# Altium project Main_Board.PrjPCB
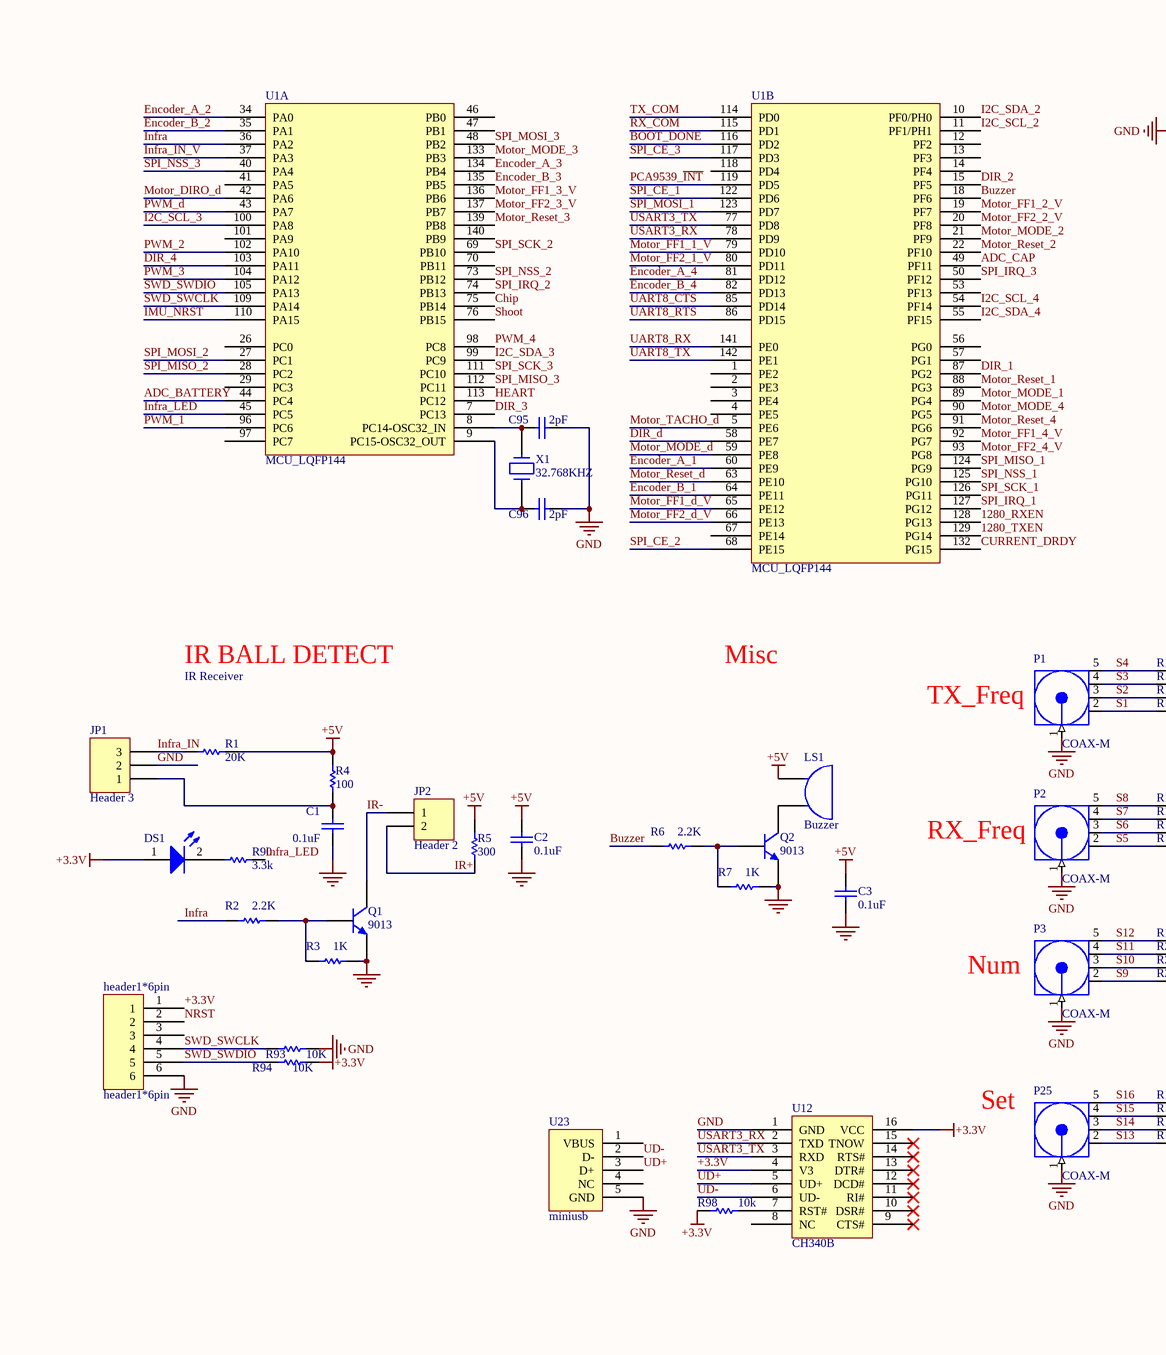
[diagram p0: Main_Board.SchDoc, left]
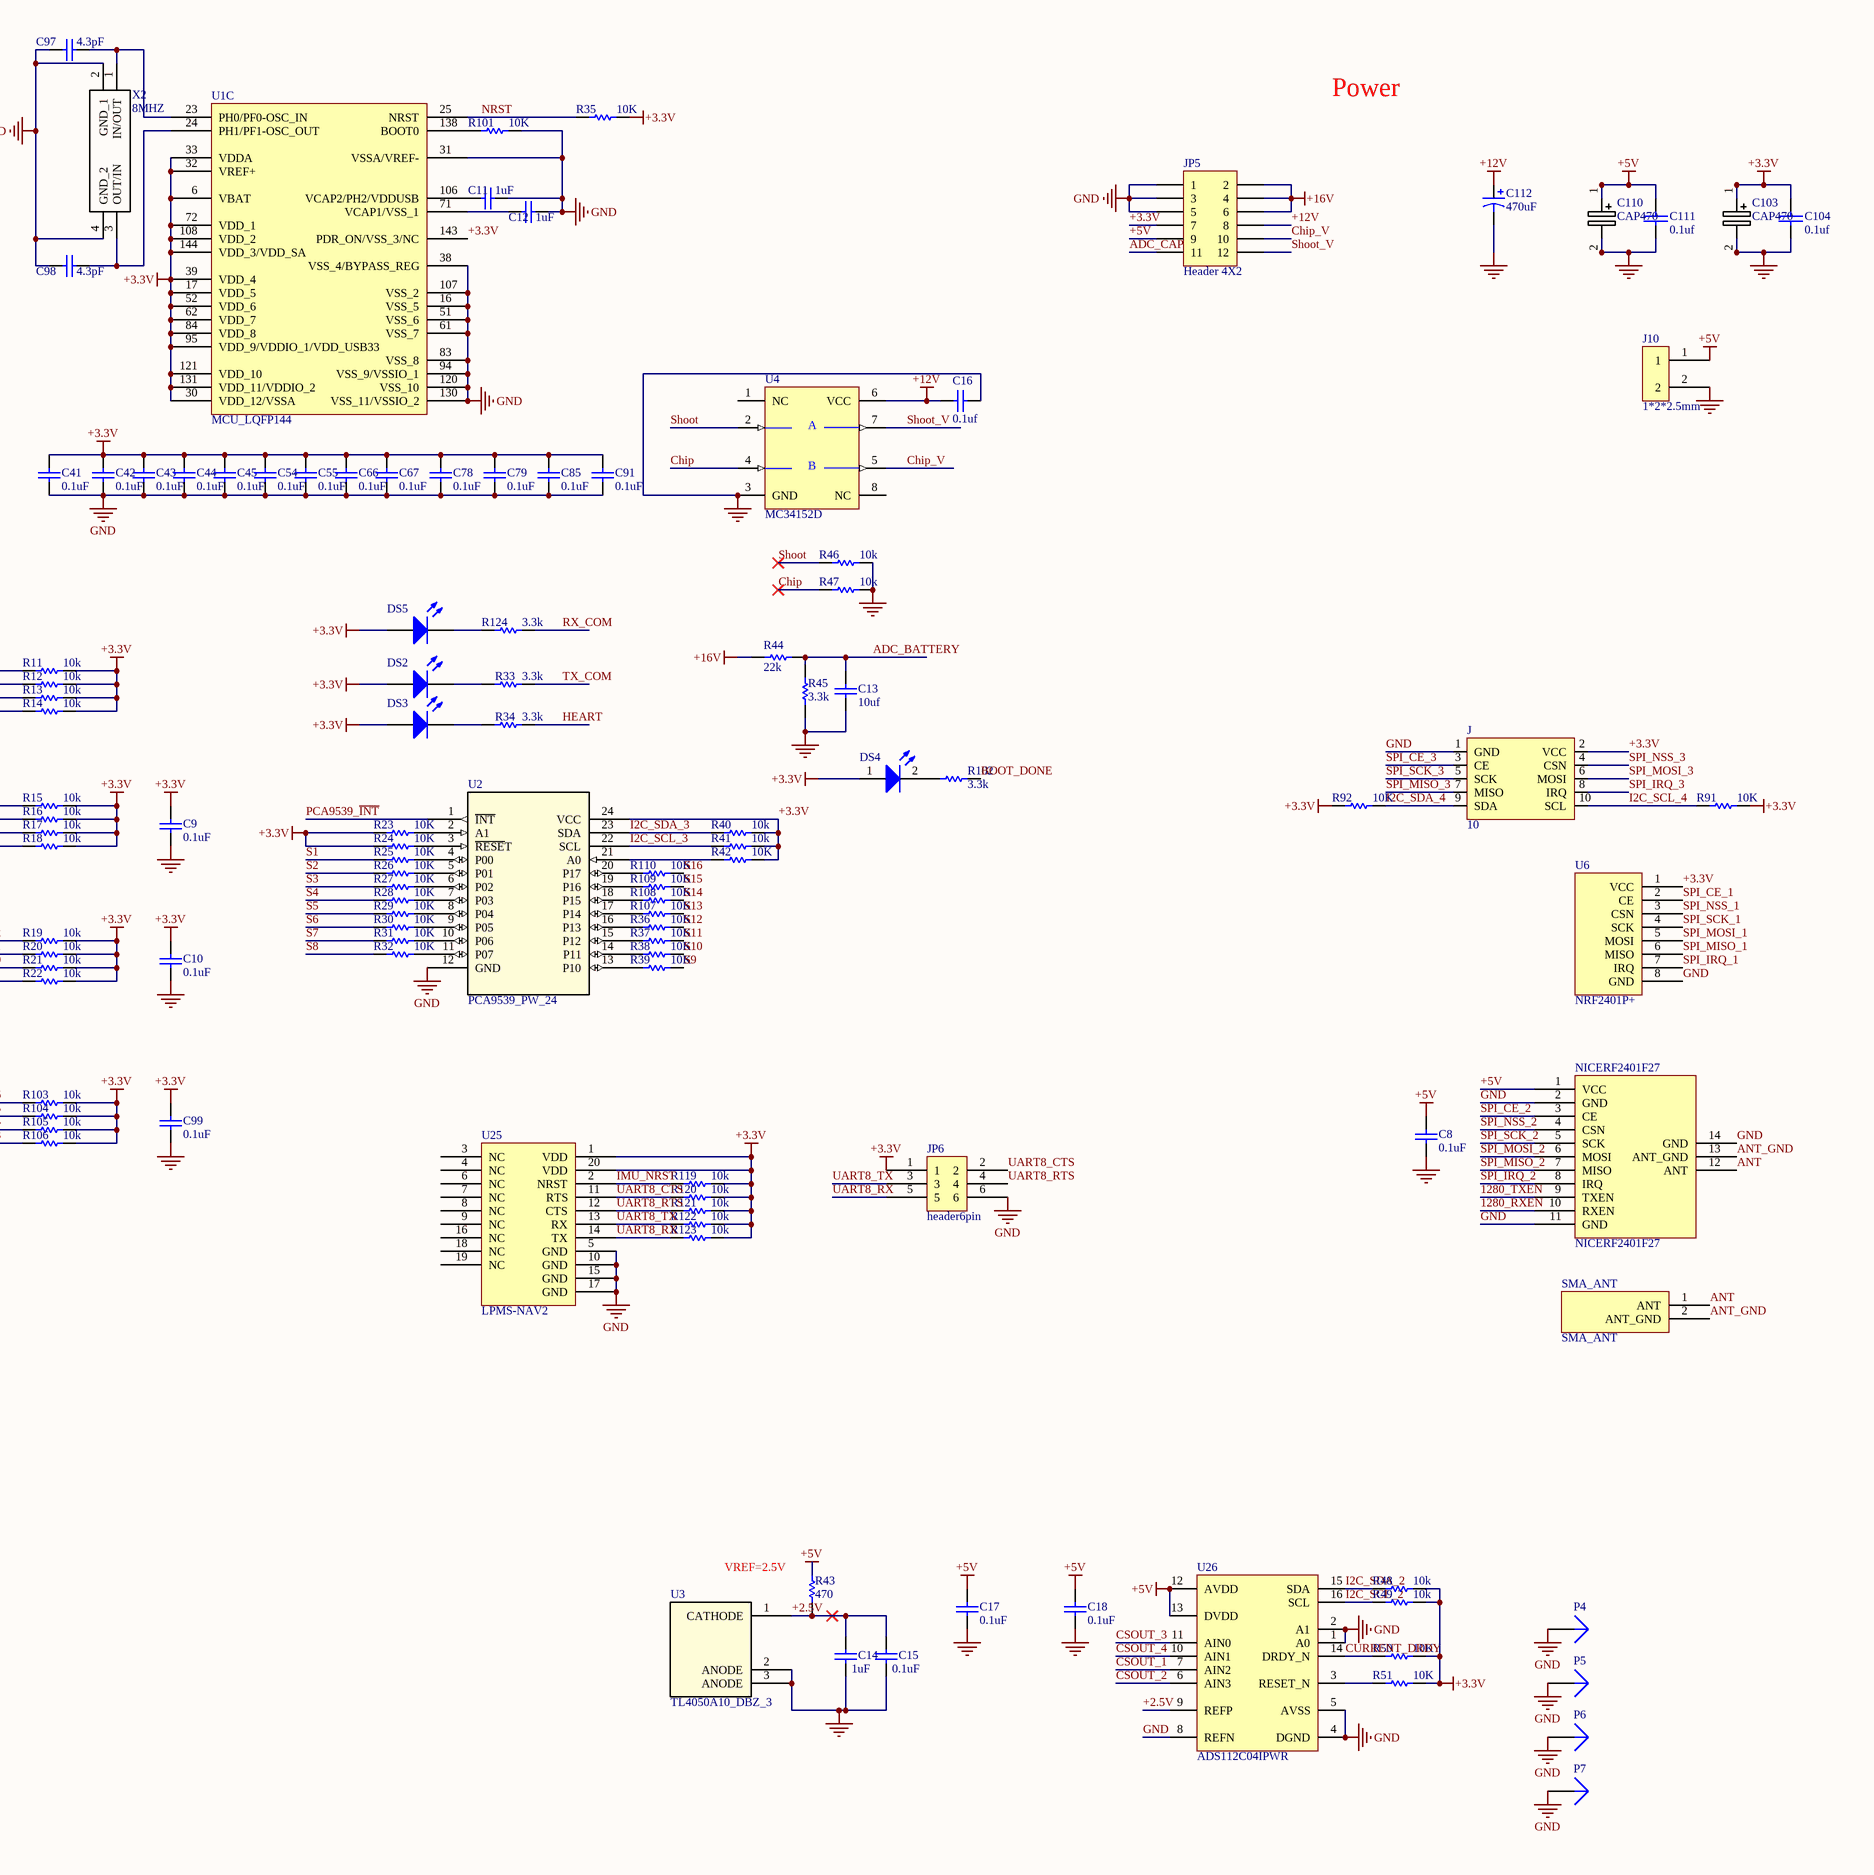
[diagram p1: Main_Board.SchDoc, right]
6 sheets, 298 parts. Net scope: global (net labels, ports and power ports of the same name join across sheets).
Board file: Copy of Main_Board.PcbDoc
Sheets:
  Main_Board.SchDoc
  Motor_1.SchDoc
  Motor_2.SchDoc
  Motor_3.SchDoc
  Motor_4.SchDoc
  Motor_d.SchDoc

## Sheet Main_Board.SchDoc
size A2

### Parts
C1  0.1uf  [0805C]
C2  0.1uf  [0805C]
C3  0.1uf  [0805C]
C8  0.1uF  [0805C]
C9  0.1uf  [0805C]
C10  0.1uf  [0805C]
C11  1uf  [0805C]
C12  1uf  [0805C]
C13  10uf  [0805C]
C14  1uf  [0805C]
C15  0.1uf  [0805C]
C16  0.1uf  [0805C]
C17  0.1uf  [0805C]
C18  0.1uf  [0805C]
C41  0.1uF  [0805C]
C42  0.1uf  [0805C]
C43  0.1uf  [0805C]
C44  0.1uf  [0805C]
C45  0.1uf  [0805C]
C54  0.1uf  [0805C]
C55  0.1uf  [0805C]
C66  0.1uf  [0805C]
C67  0.1uf  [0805C]
C78  0.1uf  [0805C]
C79  0.1uf  [0805C]
C85  0.1uf  [0805C]
C91  0.1uf  [0805C]
C95  2pf  [0805C]
C96  2pf  [0805C]
C97  4.3pf  [0805C]
C98  4.3pf  [0805C]
C99  0.1uF  [0805C]
C103  CAP470  [CAPPM7360X200N]
C104  0.1uf  [0805C]
C110  CAP470  [CAPPM7360X200N]
C111  0.1uf  [0805C]
C112  470uF  [470uF]
DS1  LED2  [0805D]  (value not drawn)
DS2  LED1  [0805D]  (value not drawn)
DS3  LED2  [0805D]  (value not drawn)
DS4  LED2  [0805D]  (value not drawn)
DS5  LED1  [0805D]  (value not drawn)
header1*6pin  header1*6pin  [1*6_2.5mm]
J  10  [10]
J10  1*2*2.5mm  [1*2_2.5mm]
JP1  Header 3  [SHDR3]
JP2  Header 2  [SHDR2]
JP5  Header 4X2  [2*6_2.5mm]
JP6  header6pin  [2*3_2.5mm]
LS1  Buzzer  [Buzzer]
NICERF2401F27  NICERF2401F27  [NICERF2401F27]
P1  COAX-M  [A6RV-161RS]
P2  COAX-M  [A6RV-161RS]
P3  COAX-M  [A6RV-161RS]
P4  安装孔  [安装孔-3.5-5]  (value not drawn)
P5  安装孔  [安装孔-3.5-5]  (value not drawn)
P6  安装孔  [安装孔-3.5-5]  (value not drawn)
P7  安装孔  [安装孔-3.5-5]  (value not drawn)
P25  COAX-M  [A6RV-161RS]
Q1  9013  [SO-G3/Y1]
Q2  9013  [SO-G3/Y1]
R1  20k  [0805R]
R2  2.2k  [0805R]
R3  1k  [0805R]
R4  100  [0805R]
R5  300  [0805R]
R6  2.2k  [0805R]
R7  1k  [0805R]
R11  10k  [0805R]
R12  10k  [0805R]
R13  10k  [0805R]
R14  10k  [0805R]
R15  10k  [0805R]
R16  10k  [0805R]
R17  10k  [0805R]
R18  10k  [0805R]
R19  10k  [0805R]
R20  10k  [0805R]
R21  10k  [0805R]
R22  10k  [0805R]
R23  10k  [0805R]
R24  10k  [0805R]
R25  10k  [0805R]
R26  10k  [0805R]
R27  10k  [0805R]
R28  10k  [0805R]
R29  10k  [0805R]
R30  10k  [0805R]
R31  10k  [0805R]
R32  10k  [0805R]
R33  3.3k  [0805R]
R34  3.3k  [0805R]
R35  10k  [0805R]
R36  10k  [0805R]
R37  10k  [0805R]
R38  10k  [0805R]
R39  10k  [0805R]
R40  10k  [0805R]
R41  10k  [0805R]
R42  10k  [0805R]
R43  470  [0805R]
R44  22k  [0805R]
R45  3.3k  [0805R]
R46  10k  [0805R]
R47  10k  [0805R]
R48  10k  [0805R]
R49  10k  [0805R]
R50  10k  [0805R]
R51  10k  [0805R]
R90  3.3k  [0805R]
R91  10k  [0805R]
R92  10k  [0805R]
R93  10k  [0805R]
R94  10k  [0805R]
R98  10k  [0805R]
R101  10k  [0805R]
R102  3.3k  [0805R]
R103  10k  [0805R]
R104  10k  [0805R]
R105  10k  [0805R]
R106  10k  [0805R]
R107  10k  [0805R]
R108  10k  [0805R]
R109  10k  [0805R]
R110  10k  [0805R]
R119  10k  [0805R]
R120  10k  [0805R]
R121  10k  [0805R]
R122  10k  [0805R]
R123  10k  [0805R]
R124  3.3k  [0805R]
SMA_ANT  SMA_ANT  [SMA_ANT]
U1  MCU_LQFP144  [LQFP144_0R5_SKT]  (parts A,B,C of 3)
U2  PCA9539_PW_24  [PW24-L_pca9539]
U3  TL4050A10_DBZ_3  [DBZ3-L]
U4  MC34152D  [SO-G8]
U6  NRF2401P+  [NRF2401P+_zeyao]
U12  CH340B  [SOP16]
U23  miniusb  [miniusb 180]
U25  LPMS-NAV2  [LPMS-NAV2]
U26  ADS112C04IPWR  [TSSOP_PW0016A_ADS112C04]
X1  32.768KHZ  [FC-255]
X2  8MHZ  [5032]

### Nets
+3.3V: C9.2 C10.2 C41.1 C42.1 C43.1 C44.1 C45.1 C54.1 C55.1 C66.1 C67.1 C78.1 C79.1 C85.1 C91.1 C99.2 C103.1(+) C104.1 DS1.1(A) DS2.1(A) DS3.1(A) DS4.1(A) DS5.1(A) header1*6pin.1 J.2(VCC) JP5.7 JP6.1 R11.2 R12.2 R13.2 R14.2 R15.2 R16.2 R17.2 R18.2 R19.2 R20.2 R21.2 R22.2 R23.1 R24.1 R35.2 R40.2 R41.2 R42.2 R48.2 R49.2 R50.2 R51.2 R91.2 R92.1 R93.1 R98.1 R103.2 R104.2 R105.2 R106.2 R119.2 R120.2 R121.2 R122.2 R123.2 U1.6(VBAT) U1.17(VDD_5) U1.30(VDD_12/VSSA) U1.32(VREF+) U1.33(VDDA) U1.39(VDD_4) U1.52(VDD_6) U1.62(VDD_7) U1.72(VDD_1) U1.84(VDD_8) U1.95(VDD_9/VDDIO_1/VDD_USB33) U1.108(VDD_2) U1.121(VDD_10) U1.131(VDD_11/VDDIO_2) U1.143(PDR_ON/VSS_3/NC) U1.144(VDD_3/VDD_SA) U2.24(VCC) U6.1(VCC) U12.4(V3) U12.16(VCC) U25.1(VDD) U25.20(VDD)
+5V: C2.2 C3.2 C8.1 C17.2 C18.2 C110.1(+) C111.1 J10.1 JP5.9 LS1.1(A) NICERF2401F27.1(VCC) R1.1 R4.2 R5.2 R43.2 U26.12(AVDD) U26.13(DVDD)
+12V: C16.1 C112.1 JP5.8 U4.6(VCC)
+16V: JP5.2 JP5.4 JP5.6 R44.2
GND: C1.2 C2.1 C3.1 C8.2 C9.1 C10.1 C11.1 C12.1 C13.1 C14.1 C15.1 C16.2 C17.1 C18.1 C41.2 C42.2 C43.2 C44.2 C45.2 C54.2 C55.2 C66.2 C67.2 C78.2 C79.2 C85.2 C91.2 C95.2 C96.2 C97.2 C98.2 C99.1 C103.2(-) C104.2 C110.2(-) C111.2 C112.2 header1*6pin.6 J.1(GND) J10.2 JP1.2 JP5.1 JP5.3 JP5.5 JP6.6 NICERF2401F27.2(GND) NICERF2401F27.11(GND) NICERF2401F27.14(GND) P1.1(Signal) P2.1(Signal) P3.1(Signal) P4.1 P5.1 P6.1 P7.1 P25.1(Signal) Q1.2(E) Q2.2(E) R3.2 R7.2 R45.1 R46.1 R47.1 R94.1 R101.2 U1.16(VSS_5) U1.31(VSSA/VREF-) U1.38(VSS_4/BYPASS_REG) U1.51(VSS_6) U1.61(VSS_7) U1.83(VSS_8) U1.94(VSS_9/VSSIO_1) U1.107(VSS_2) U1.120(VSS_10) U1.130(VSS_11/VSSIO_2) U2.12(GND) U3.2(ANODE) U3.3(ANODE) U4.3(GND) U6.8(GND) U12.1(GND) U23.5(GND) U25.5(GND) U25.10(GND) U25.15(GND) U25.17(GND) U26.1(A0) U26.2(A1) U26.4(DGND) U26.5(AVSS) U26.8(REFN) X2.2(GND_1) X2.4(GND_2)
1280_RXEN: NICERF2401F27.10(RXEN) U1.128(PG13)
1280_TXEN: NICERF2401F27.9(TXEN) U1.129(PG14)
+2.5V: C14.2 C15.2 R43.1 U3.1(CATHODE) U26.9(REFP)
ADC_BATTERY: C13.2 R44.1 R45.2 U1.44(PC4)
ADC_CAP: JP5.11 U1.49(PF11)
ANT: NICERF2401F27.12(ANT) SMA_ANT.1(ANT)
ANT_GND: NICERF2401F27.13(ANT_GND) SMA_ANT.2(ANT_GND)
BOOT_DONE: R102.1 U1.116(PD2)
Buzzer: R6.1 U1.18(PF6)
Chip: R47.2 U1.75(PB14) U4.4(INB)
Chip_V: JP5.10 U4.5(~{OUTB})
CSOUT_1: U26.7(AIN2)
CSOUT_2: U26.6(AIN3)
CSOUT_3: U26.11(AIN0)
CSOUT_4: U26.10(AIN1)
CURRENT_DRDY: R50.1 U1.132(PG15) U26.14(DRDY_N)
DIR_1: U1.87(PG2)
DIR_2: U1.15(PF5)
DIR_3: U1.7(PC13)
DIR_4: U1.103(PA11)
DIR_d: U1.58(PE7)
Encoder_A_1: U1.60(PE9)
Encoder_A_2: U1.34(PA0)
Encoder_A_3: U1.134(PB4)
Encoder_A_4: U1.81(PD12)
Encoder_B_1: U1.64(PE11)
Encoder_B_2: U1.35(PA1)
Encoder_B_3: U1.135(PB5)
Encoder_B_4: U1.82(PD13)
HEART: R34.1 U1.113(PC12)
I2C_SCL_2: R49.1 U1.11(PF1/PH1) U26.16(SCL)
I2C_SCL_3: R41.1 U1.100(PA8) U2.22(SCL)
I2C_SCL_4: J.10(SCL) R91.1 U1.54(PF14)
I2C_SDA_2: R48.1 U1.10(PF0/PH0) U26.15(SDA)
I2C_SDA_3: R40.1 U1.99(PC9) U2.23(SDA)
I2C_SDA_4: J.9(SDA) R92.2 U1.55(PF15)
IMU_NRST: R119.1 U1.110(PA15) U25.2(NRST)
Infra: R2.1 U1.36(PA2)
Infra_IN: JP1.3 R1.2
Infra_IN_V: U1.37(PA3)
Infra_LED: R90.1 U1.45(PC5)
IR+: JP2.1(2) R5.1
IR-: JP2.2(1) Q1.3(C)
Motor_DIRO_d: U1.42(PA6)
Motor_FF1_1_V: U1.79(PD10)
Motor_FF1_2_V: U1.19(PF7)
Motor_FF1_3_V: U1.136(PB6)
Motor_FF1_4_V: U1.92(PG7)
Motor_FF1_d_V: U1.65(PE12)
Motor_FF2_1_V: U1.80(PD11)
Motor_FF2_2_V: U1.20(PF8)
Motor_FF2_3_V: U1.137(PB7)
Motor_FF2_4_V: U1.93(PG8)
Motor_FF2_d_V: U1.66(PE13)
Motor_MODE_1: U1.89(PG4)
Motor_MODE_2: U1.21(PF9)
Motor_MODE_3: U1.133(PB3)
Motor_MODE_4: U1.90(PG5)
Motor_MODE_d: U1.59(PE8)
Motor_Reset_1: U1.88(PG3)
Motor_Reset_2: U1.22(PF10)
Motor_Reset_3: U1.139(PB8)
Motor_Reset_4: U1.91(PG6)
Motor_Reset_d: U1.63(PE10)
Motor_TACHO_d: U1.5(PE6)
NRST: header1*6pin.2 R35.1 U1.25(NRST)
PCA9539_~{INT}: U1.119(PD5) U2.1(~{INT})
PWM_1: U1.96(PC6)
PWM_2: U1.102(PA10)
PWM_3: U1.104(PA12)
PWM_4: U1.98(PC8)
PWM_d: U1.43(PA7)
RX_COM: R124.1 U1.115(PD1)
S1: P1.2(GND) R14.1 R25.1
S2: P1.3(GND) R13.1 R26.1
S3: P1.4(GND) R12.1 R27.1
S4: P1.5(GND) R11.1 R28.1
S5: P2.2(GND) R18.1 R29.1
S6: P2.3(GND) R17.1 R30.1
S7: P2.4(GND) R16.1 R31.1
S8: P2.5(GND) R15.1 R32.1
S9: P3.2(GND) R22.1 R39.2
S10: P3.3(GND) R21.1 R38.2
S11: P3.4(GND) R20.1 R37.2
S12: P3.5(GND) R19.1 R36.2
S13: P25.2(GND) R106.1 R107.2
S14: P25.3(GND) R105.1 R108.2
S15: P25.4(GND) R104.1 R109.2
S16: P25.5(GND) R103.1 R110.2
Shoot: R46.2 U1.76(PB15) U4.2(INA)
Shoot_V: JP5.12 U4.7(~{OUTA})
SPI_CE_1: U1.122(PD6) U6.2(CE)
SPI_CE_2: NICERF2401F27.3(CE) U1.68(PE15)
SPI_CE_3: J.3(CE) U1.117(PD3)
SPI_IRQ_1: U1.127(PG12) U6.7(IRQ)
SPI_IRQ_2: NICERF2401F27.8(IRQ) U1.74(PB13)
SPI_IRQ_3: J.8(IRQ) U1.50(PF12)
SPI_MISO_1: U1.124(PG9) U6.6(MISO)
SPI_MISO_2: NICERF2401F27.7(MISO) U1.28(PC2)
SPI_MISO_3: J.7(MISO) U1.112(PC11)
SPI_MOSI_1: U1.123(PD7) U6.5(MOSI)
SPI_MOSI_2: NICERF2401F27.6(MOSI) U1.27(PC1)
SPI_MOSI_3: J.6(MOSI) U1.48(PB2)
SPI_NSS_1: U1.125(PG10) U6.3(CSN)
SPI_NSS_2: NICERF2401F27.4(CSN) U1.73(PB12)
SPI_NSS_3: J.4(CSN) U1.40(PA4)
SPI_SCK_1: U1.126(PG11) U6.4(SCK)
SPI_SCK_2: NICERF2401F27.5(SCK) U1.69(PB10)
SPI_SCK_3: J.5(SCK) U1.111(PC10)
SWD_SWCLK: header1*6pin.4 R94.2 U1.109(PA14)
SWD_SWDIO: header1*6pin.5 R93.2 U1.105(PA13)
TX_COM: R33.1 U1.114(PD0)
UART8_CTS: JP6.2 R120.1 U1.85(PD14) U25.11(RTS)
UART8_RTS: JP6.4 R121.1 U1.86(PD15) U25.12(CTS)
UART8_RX: JP6.5 R123.1 U1.141(PE0) U25.14(TX)
UART8_TX: JP6.3 R122.1 U1.142(PE1) U25.13(RX)
UD+: U12.5(UD+) U23.3(D+)
UD-: U12.6(UD-) U23.2(D-)
USART3_RX: U1.78(PD9) U12.2(TXD)
USART3_TX: U1.77(PD8) U12.3(RXD)
NetC1_1: C1.1 JP1.1 R4.1
NetC11_2: C11.2 U1.106(VCAP2/PH2/VDDUSB)
NetC12_2: C12.2 U1.71(VCAP1/VSS_1)
NetC95_1: C95.1 U1.8(PC14-OSC32_IN) X1.2
NetC96_1: C96.1 U1.9(PC15-OSC32_OUT) X1.1
NetC97_1: C97.1 U1.23(PH0/PF0-OSC_IN) X2.1(IN/OUT)
NetC98_1: C98.1 U1.24(PH1/PF1-OSC_OUT) X2.3(OUT/IN)
NetDS1_2: DS1.2(K) R90.2
NetDS2_2: DS2.2(K) R33.2
NetDS3_2: DS3.2(K) R34.2
NetDS4_2: DS4.2(K) R102.2
NetDS5_2: DS5.2(K) R124.2
NetLS1_2: LS1.2(B) Q2.3(C)
NetQ1_1: Q1.1(B) R2.2 R3.1
NetQ2_1: Q2.1(B) R6.2 R7.1
NetR23_2: R23.2 U2.2(A1)
NetR24_2: R24.2 U2.3(~{RESE}T)
NetR25_2: R25.2 U2.4(P00)
NetR26_2: R26.2 U2.5(P01)
NetR27_2: R27.2 U2.6(P02)
NetR28_2: R28.2 U2.7(P03)
NetR29_2: R29.2 U2.8(P04)
NetR30_2: R30.2 U2.9(P05)
NetR31_2: R31.2 U2.10(P06)
NetR32_2: R32.2 U2.11(P07)
NetR36_1: R36.1 U2.16(P13)
NetR37_1: R37.1 U2.15(P12)
NetR38_1: R38.1 U2.14(P11)
NetR39_1: R39.1 U2.13(P10)
NetR42_1: R42.1 U2.21(A0)
NetR51_1: R51.1 U26.3(RESET_N)
NetR98_2: R98.2 U12.7(RST#)
NetR101_1: R101.1 U1.138(BOOT0)
NetR107_1: R107.1 U2.17(P14)
NetR108_1: R108.1 U2.18(P15)
NetR109_1: R109.1 U2.19(P16)
NetR110_1: R110.1 U2.20(P17)

Not connected (* = marked no-connect by the designer): header1*6pin 3; U1 1(PE2) 2(PE3) 3(PE4) 4(PE5) 12(PF2) 13(PF3) 14(PF4) 26(PC0) 29(PC3) 41(PA5) 46(PB0) 47(PB1) 53(PF13) 56(PG0) 57(PG1) 67(PE14) 70(PB11) 97(PC7) 101(PA9) 118(PD4) 140(PB9); U4 1(NC) 8(NC); U12 8(NC) 9(CTS#)* 10(DSR#)* 11(RI#)* 12(DCD#)* 13(DTR#)* 14(RTS#)* 15(TNOW)*; U23 1(VBUS) 4(NC); U25 3(NC) 4(NC) 6(NC) 7(NC) 8(NC) 9(NC) 16(NC) 18(NC) 19(NC)

### Notes on the sheet
- Power
- IR Receiver
- IR BALL DETECT
- Misc
- (near P1) TX_Freq
- (near P2) RX_Freq
- Num
- (near P25) Set
- VREF=2.5V
- (in symbol MC34152D) A; B

### Library data of the parts
C1-C3 C8-C13 C16 C41-C45 C54 C55 C66 C67 C78 C79 C85 C91 C95-C99 = Cap: Capacitor; Published: 8-Jun-2000; LatestRevisionDate: 17-Jul-2002; LatestRevisionNote: Re-released for DXP Platform.; Publisher: Altium Limited
  C1-C3 C8-C10 C41-C45 C54 C55 C66 C67 C78 C79 C85 C91 C99: Value: 0.1uF
  C11 C12: Value: 1uF
  C95 C96: Value: 2pF
  C97 C98: Value: 4.3pF
C14 C15 C17 C18 = Cap: Capacitor; Manufacturer: Generic Components; Class: Passive; Published: 08/06/2000; Publisher: Altium Hobart Technology Centre; SubClass: Capacitor
  C14: Value: 1uF
  C15 C17 C18: Value: 0.1uF
C103 C110 = T523H477M016APE0707280: 470uF电容贴片; Manufacturer_Name: Kemet; Datasheet Link: https://api.kemet.com/component-edge/download/datasheet/T523H477M016APE0707280.pdf; Height: 2mm; Manufacturer_Part_Number: T523H477M016APE0707280; Mouser Part Number: 80-T523H477M16P070LR; Mouser Price/Stock: https://www.mouser.com/Search/Refine.aspx?Keyword=80-T523H477M16P070LR
C104 C111 = CAP: Capacitor
C112 = Cap Pol1: Polarized Capacitor (Radial); Published: 8-Jun-2000; LatestRevisionDate: 17-Jul-2002; LatestRevisionNote: Re-released for DXP Platform.; PackageReference: RB7.6-15; Publisher: Altium Limited; PackageDescription: Polarized Capacitor (Radial); 2 Leads
DS1 DS4 = LED2: Typical RED, GREEN, YELLOW, AMBER GaAs LED; Manufacturer: Generic Components; Class: Optoelectronic; Published: 08/06/2000; Publisher: Altium Hobart Technology Centre; SubClass: LED
DS2 DS5 = LED1: Typical RED, GREEN, YELLOW, AMBER GaAs LED; Published: 8-Jun-2000; LatestRevisionDate: 17-Jul-2002; LatestRevisionNote: Re-released for DXP Platform.; Publisher: Altium Limited
DS3 = LED2: Typical RED, GREEN, YELLOW, AMBER GaAs LED; Published: 8-Jun-2000; LatestRevisionDate: 17-Jul-2002; LatestRevisionNote: Re-released for DXP Platform.; Publisher: Altium Limited
JP1 = Header 3: Header, 3-Pin; LatestRevisionDate: 17-Jul-2002; LatestRevisionNote: Re-released for DXP Platform.; Publisher: Altium Limited
JP2 = Header 2: Header, 2-Pin; LatestRevisionDate: 17-Jul-2002; LatestRevisionNote: Re-released for DXP Platform.; Publisher: Altium Limited
JP5 = Header 6X2: Header, 4-Pin, Dual row; LatestRevisionDate: 17-Jul-2002; LatestRevisionNote: Re-released for DXP Platform.; Publisher: Altium Limited
LS1 = Buzzer: Manufacturer: Generic Components; Published: 1999
P1-P3 P25 = COAX-M: RF Coaxial PCB Connector, MMCX; Thru-Hole, Vertical Mount Plug,  50 Ohm Impedance; PackageDocument: Rev. A, 16-Jun-1997; PCB_Layout: Complies with manufacturer's recommendation.; DrillSize: Corresponds to nominal value.; Published: 15-Jul-2004; LatestRevisionDate: 15-Jul-2004; LatestRevisionNote: Component Replaced.; DatasheetDocument: 30-May-2003; PackageReference: 908-21103; Publisher: Altium Limited; ComponentLink1Description: Manufacturer Link; ComponentLink1URL: http://www.amphenolrf.com/
P4-P7 = Plug: LatestRevisionDate: 17-Jul-2002; LatestRevisionNote: Re-released for DXP Platform.; Publisher: Altium Limited
Q1 Q2 = BC817-40: NPN General Purpose Amplifier; Manufacturer: Fairchild Semiconductor; Revised: 11-July-2000: SIM Model Added.; Class: Discrete; SubClass: BJT - Low Power; Published: 8/06/2000; Publisher: Altium Hobart Technology Centre
R1-R7 R11-R45 R48-R51 R90-R94 R98 R101-R110 R119-R124 = Res1: Resistor; Manufacturer: Generic Components; Class: Passive; Published: 08/06/2000; Publisher: Altium Hobart Technology Centre; SubClass: Resistor
  R1: Value: 20K
  R2 R6: Value: 2.2K
  R3 R7: Value: 1K
  R4: Value: 100
  R5: Value: 300
  R11-R22 R40 R41 R48 R49 R98 R103-R106 R119-R123: Value: 10k
  R23-R32 R35-R39 R42 R50 R51 R91-R94 R101 R107-R110: Value: 10K
  R33 R34 R45 R90 R102 R124: Value: 3.3k
  R43: Value: 470
  R44: Value: 22k
R46 R47 = SR0805: Resistance; VALUE: 10k
U2 = PCA9539_PW_24: Remote 16-Bit I2C And SMBus, Low-Power I/O Expander With Interrupt Output, Reset & Config. Registers; Vendor: Texas Instruments; PACKAGE_DESIGNATOR: PW; PIN_COUNT: 24; FAMILY_NAME: I2C IO EXPANDER; INDUSTRY_STD_PKG_TYPE: TSSOP; Manufacturer_Part_Number: pca9539_pw_24; GENERIC_PART_NUMBER: PCA9539; Datasheet_URL: http://www.ti.com/lit/gpn/PCA9539; Manufacturer: Texas Instruments; RefDes: RefDes; Type: DEV; Value: Value
U3 = TL4050A10_DBZ_3: Precision Micropower Shunt Voltage Reference; Vendor: Texas Instruments; PACKAGE_DESIGNATOR: DBZ; PIN_COUNT: 3; INDUSTRY_STD_PKG_TYPE: SOT-23; Manufacturer_Part_Number: tl4050a10_dbz_3; GENERIC_PART_NUMBER: TL4050A10; FAMILY_NAME: SHUNT VOLTAGE REFERENCE; Datasheet_URL: http://www.ti.com/lit/gpn/TL4050A10; Manufacturer: Texas Instruments; RefDes: RefDes; Type: DEV; Value: Value
U4 = MC34152D: High Speed Dual MOSFET Driver; Manufacturer: Motorola; Class: Interface; Published: 15/04/2002; Publisher: Altium Hobart Technology Centre; SubClass: MOSFET Driver
U26 = ADS112C04IPWR: Imported; Manufacturer: Texas Instruments; PartNumber: ADS112C04IPWR; RefDes: RefDes; Type: DEV; Value: Value
X1 = CRYSTAL
X2 = ECS-80-18-30B-AGN-TR: Crystal or Oscillator; Manufacturer_Name: ECS; Datasheet Link: http://www.ecsxtal.com/store/pdf/ecx_53b.pdf; Height: 0.85mm; Manufacturer_Part_Number: ECS-80-18-30B-AGN-TR; Mouser Part Number: 520-80-18-30B-AGNT; Mouser Price/Stock: https://www.mouser.com/Search/Refine.aspx?Keyword=520-80-18-30B-AGNT

## Sheet Motor_1.SchDoc
size A4
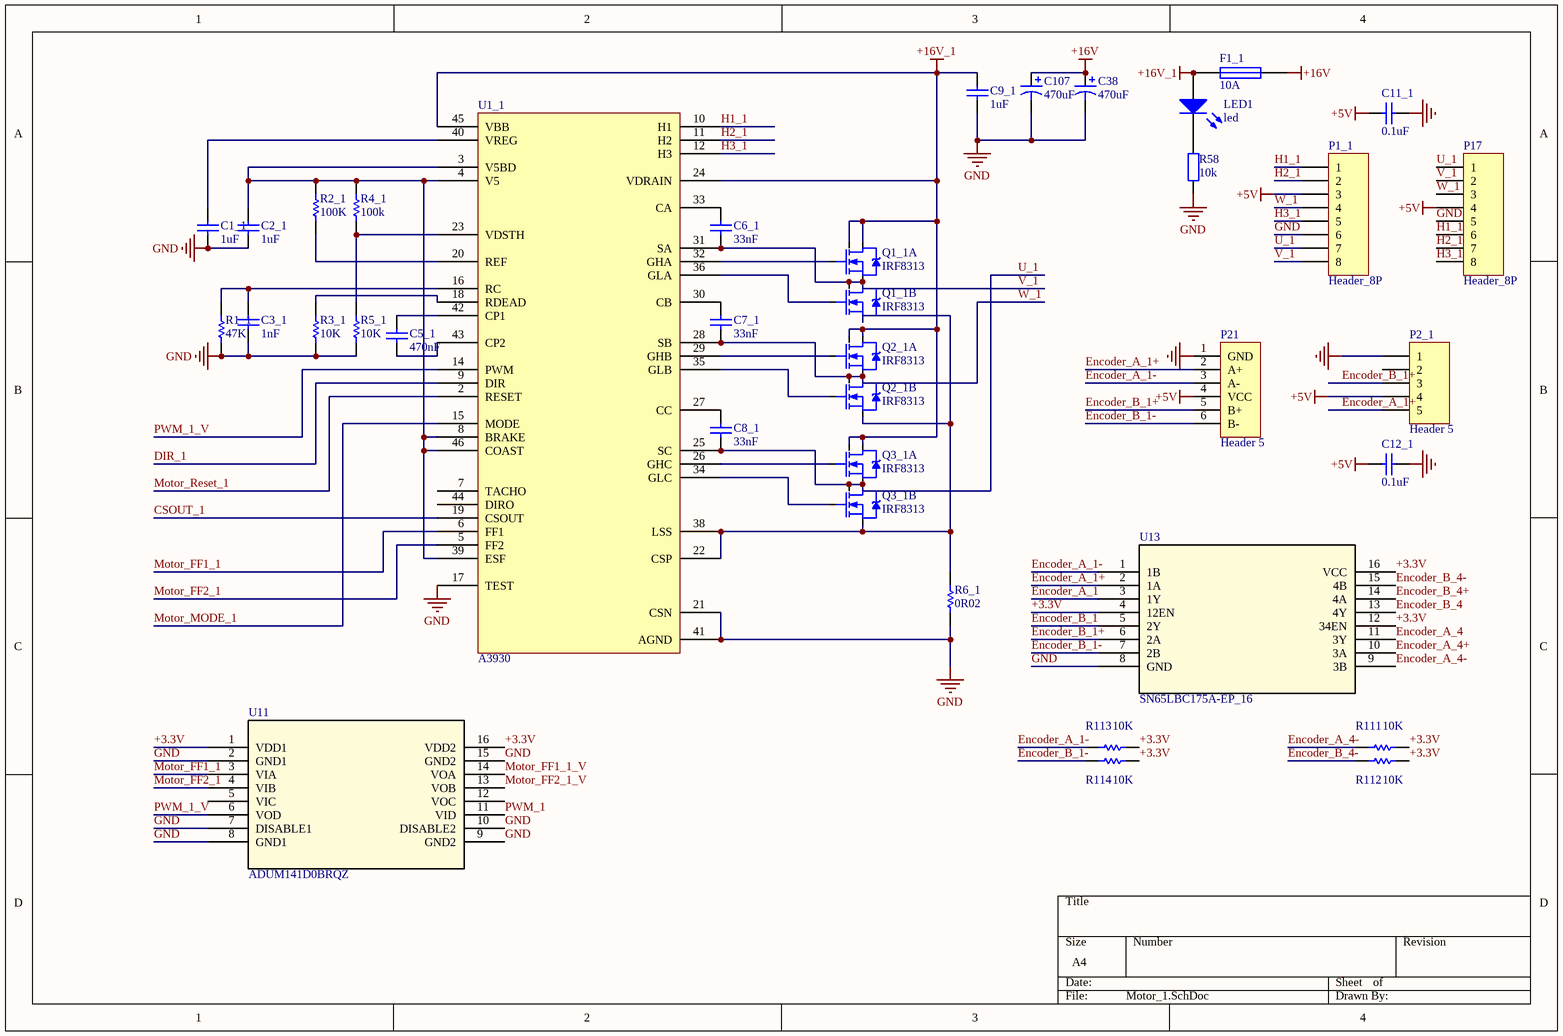
[diagram p2: Motor_1.SchDoc]

### Parts
C1_1  1uf  [0603C]
C2_1  1uf  [0603C]
C3_1  1nf  [0603C]
C5_1  470nf  [0603C]
C6_1  33nf  [0603C]
C7_1  33nf  [0603C]
C8_1  33nf  [0603C]
C9_1  1uf  [0603C]
C11_1  0.1uf  [0603C]
C12_1  0.1uf  [0603C]
C38  470uF  [470uF]
C107  470uF  [470uF]
F1_1  10A  [FUSE_HEADER]
LED1  led  [0603_diode]
P1_1  Header_8P  [8P - WF25122]
P2_1  Header 5  [SHDR5]
P17  Header_8P  [SHDR8]
P21  Header 5  [SHDR6]
Q1_1  IRF8313  [so-8 bg]  (parts A,B of 2)
Q2_1  IRF8313  [so-8 bg]  (parts A,B of 2)
Q3_1  IRF8313  [so-8 bg]  (parts A,B of 2)
R1_1  47k  [0603R]
R2_1  100k  [0603R]
R3_1  10k  [0603R]
R4_1  100k  [0603R]
R5_1  10k  [0603R]
R6_1  value 0R02  [1206 10A]  (hidden comment: 0.02)
R58  10k  [0603]
R111  10k  [0603R]
R112  10k  [0603R]
R113  10k  [0603R]
R114  10k  [0603R]
U1_1  A3930  [LQFP-48]
U11  ADUM141D0BRQZ  [RQ_16]
U13  SN65LBC175A-EP_16  [SOP16]

### Nets
+3.3V: R111.1 R112.1 R113.1 R114.1 U11.1(VDD1) U11.16(VDD2) U13.4(12EN) U13.12(34EN) U13.16(VCC)
+5V: C11_1.2 C12_1.2 P1_1.3 P2_1.4 P17.4 P21.4(VCC)
+16V: C38.1 C107.1 F1_1.1
+16V_1: C9_1.2 F1_1.2 LED1.1(A) Q1_1.7(D2) Q1_1.8(D2) Q2_1.7(D2) Q2_1.8(D2) Q3_1.7(D2) Q3_1.8(D2) U1_1.24(VDRAIN) U1_1.45(VBB)
GND: C1_1.1 C2_1.1 C3_1.1 C9_1.1 C11_1.1 C12_1.1 C38.2 C107.2 P1_1.6 P2_1.1 P17.5 P21.1(GND) R1_1.1 R3_1.1 R5_1.1 R6_1.1 R58.1 U1_1.17(TEST) U1_1.21(CSN) U1_1.41(AGND) U11.2(GND1) U11.7(DISABLE1) U11.8(GND1) U11.9(GND2) U11.10(DISABLE2) U11.15(GND2) U13.8(GND)
CSOUT_1: U1_1.19(CSOUT)
DIR_1: U1_1.9(DIR)
Encoder_A_1: U13.3(1Y)
Encoder_A_1+: P2_1.5 P21.2(A+) U13.2(1A)
Encoder_A_1-: P21.3(A-) R113.2 U13.1(1B)
Encoder_A_4: U13.11(3Y)
Encoder_A_4+: U13.10(3A)
Encoder_A_4-: R111.2 U13.9(3B)
Encoder_B_1: U13.5(2Y)
Encoder_B_1+: P2_1.3 P21.5(B+) U13.6(2A)
Encoder_B_1-: P21.6(B-) R114.2 U13.7(2B)
Encoder_B_4: U13.13(4Y)
Encoder_B_4+: U13.14(4A)
Encoder_B_4-: R112.2 U13.15(4B)
H1_1: P1_1.1 P17.6 U1_1.10(H1)
H2_1: P1_1.2 P17.7 U1_1.11(H2)
H3_1: P1_1.5 P17.8 U1_1.12(H3)
Motor_FF1_1: U1_1.6(FF1) U11.3(VIA)
Motor_FF1_1_V: U11.14(VOA)
Motor_FF2_1: U1_1.5(FF2) U11.4(VIB)
Motor_FF2_1_V: U11.13(VOB)
Motor_MODE_1: U1_1.15(MODE)
Motor_Reset_1: U1_1.2(RESET)
PWM_1: U11.11(VID)
PWM_1_V: U1_1.14(PWM) U11.6(VOD)
U_1: C8_1.1 P1_1.7 P17.1 Q3_1.1(S2) Q3_1.5(D1) Q3_1.6(D1) U1_1.25(SC)
V_1: C6_1.1 P1_1.8 P17.2 Q1_1.1(S2) Q1_1.5(D1) Q1_1.6(D1) U1_1.31(SA)
W_1: C7_1.1 P1_1.4 P17.3 Q2_1.1(S2) Q2_1.5(D1) Q2_1.6(D1) U1_1.28(SB)
NetC1_1_2: C1_1.2 U1_1.40(VREG)
NetC2_1_2: C2_1.2 R2_1.2 R4_1.2 U1_1.3(V5BD) U1_1.4(V5) U1_1.8(BRAKE) U1_1.39(ESF) U1_1.46(COAST)
NetC3_1_2: C3_1.2 R1_1.2 U1_1.16(RC)
NetC5_1_1: C5_1.1 U1_1.43(CP2)
NetC5_1_2: C5_1.2 U1_1.42(CP1)
NetC6_1_2: C6_1.2 U1_1.33(CA)
NetC7_1_2: C7_1.2 U1_1.30(CB)
NetC8_1_2: C8_1.2 U1_1.27(CC)
NetLED1_2: LED1.2(K) R58.2
NetQ1_1_2: Q1_1.2(G2) U1_1.32(GHA)
NetQ1_1_3: Q1_1.3(S1) Q2_1.3(S1) Q3_1.3(S1) R6_1.2 U1_1.22(CSP) U1_1.38(LSS)
NetQ1_1_4: Q1_1.4(G1) U1_1.36(GLA)
NetQ2_1_2: Q2_1.2(G2) U1_1.29(GHB)
NetQ2_1_4: Q2_1.4(G1) U1_1.35(GLB)
NetQ3_1_2: Q3_1.2(G2) U1_1.26(GHC)
NetQ3_1_4: Q3_1.4(G1) U1_1.34(GLC)
NetR2_1_1: R2_1.1 U1_1.20(REF)
NetR3_1_2: R3_1.2 U1_1.18(RDEAD)
NetR4_1_1: R4_1.1 R5_1.2 U1_1.23(VDSTH)

Not connected (* = marked no-connect by the designer): P2_1 2; U1_1 7(TACHO) 44(DIRO); U11 5(VIC) 12(VOC)

### Library data of the parts
C1_1 C2_1 C3_1 C5_1 C6_1 C7_1 C8_1 C9_1 C11_1 C12_1 = Cap: as C14 on sheet Main_Board; Published: 08/06/2000; Publisher: Altium Hobart Technology Centre; SubClass: Capacitor
  C1_1 C2_1 C9_1: Value: 1uF
  C3_1: Value: 1nF
  C5_1: Value: 470nF
  C6_1 C7_1 C8_1: Value: 33nF
  C11_1 C12_1: Value: 0.1uF
C38 C107 = Cap Pol1: Polarized Capacitor (Radial); Published: 8-Jun-2000; LatestRevisionDate: 17-Jul-2002; LatestRevisionNote: Re-released for DXP Platform.; PackageReference: RB7.6-15; Publisher: Altium Limited; PackageDescription: Polarized Capacitor (Radial); 2 Leads
F1_1 = FUSE
P1_1 P17 = Header_8P: Used for Motor connection in ZJUNlict
P2_1 = Header 5: Header, 5-Pin; LatestRevisionDate: 17-Jul-2002; LatestRevisionNote: Re-released for DXP Platform.; Publisher: Altium Limited
P21 = Header 6: Header, 5-Pin; LatestRevisionDate: 17-Jul-2002; LatestRevisionNote: Re-released for DXP Platform.; Publisher: Altium Limited
Q1_1 Q2_1 Q3_1 = SO-8 IRF8313
R1_1 R2_1 R3_1 R4_1 R5_1 R6_1 R111-R114 = Res1: as R1 on sheet Main_Board; Published: 08/06/2000; Publisher: Altium Hobart Technology Centre; SubClass: Resistor
  R1_1: Value: 47K
  R2_1: Value: 100K
  R3_1 R5_1 R111-R114: Value: 10K
  R4_1: Value: 100k
R58 = res
U1_1 = LQFP 48
U11 = ADUM141D0BRQZ: Imported; RefDes: RefDes; Type: DEV; Value: Value
U13 = SN65LBC175A-EP_16: Quadruple 2-Input Positive-NAND Gates; Manufacturer: Texas Instruments; GENERIC_PART_NUMBER: 74AC11000; INDUSTRY_STD_PKG_TYPE: SOIC; PIN_COUNT: 16; PACKAGE_DESIGNATOR: D; Datasheet_URL: http://www.ti.com/lit/gpn/74AC11000; FAMILY_NAME: NAND GATE; RefDes: RefDes; Type: DEV; Value: Value

## Sheet Motor_2.SchDoc
size A4
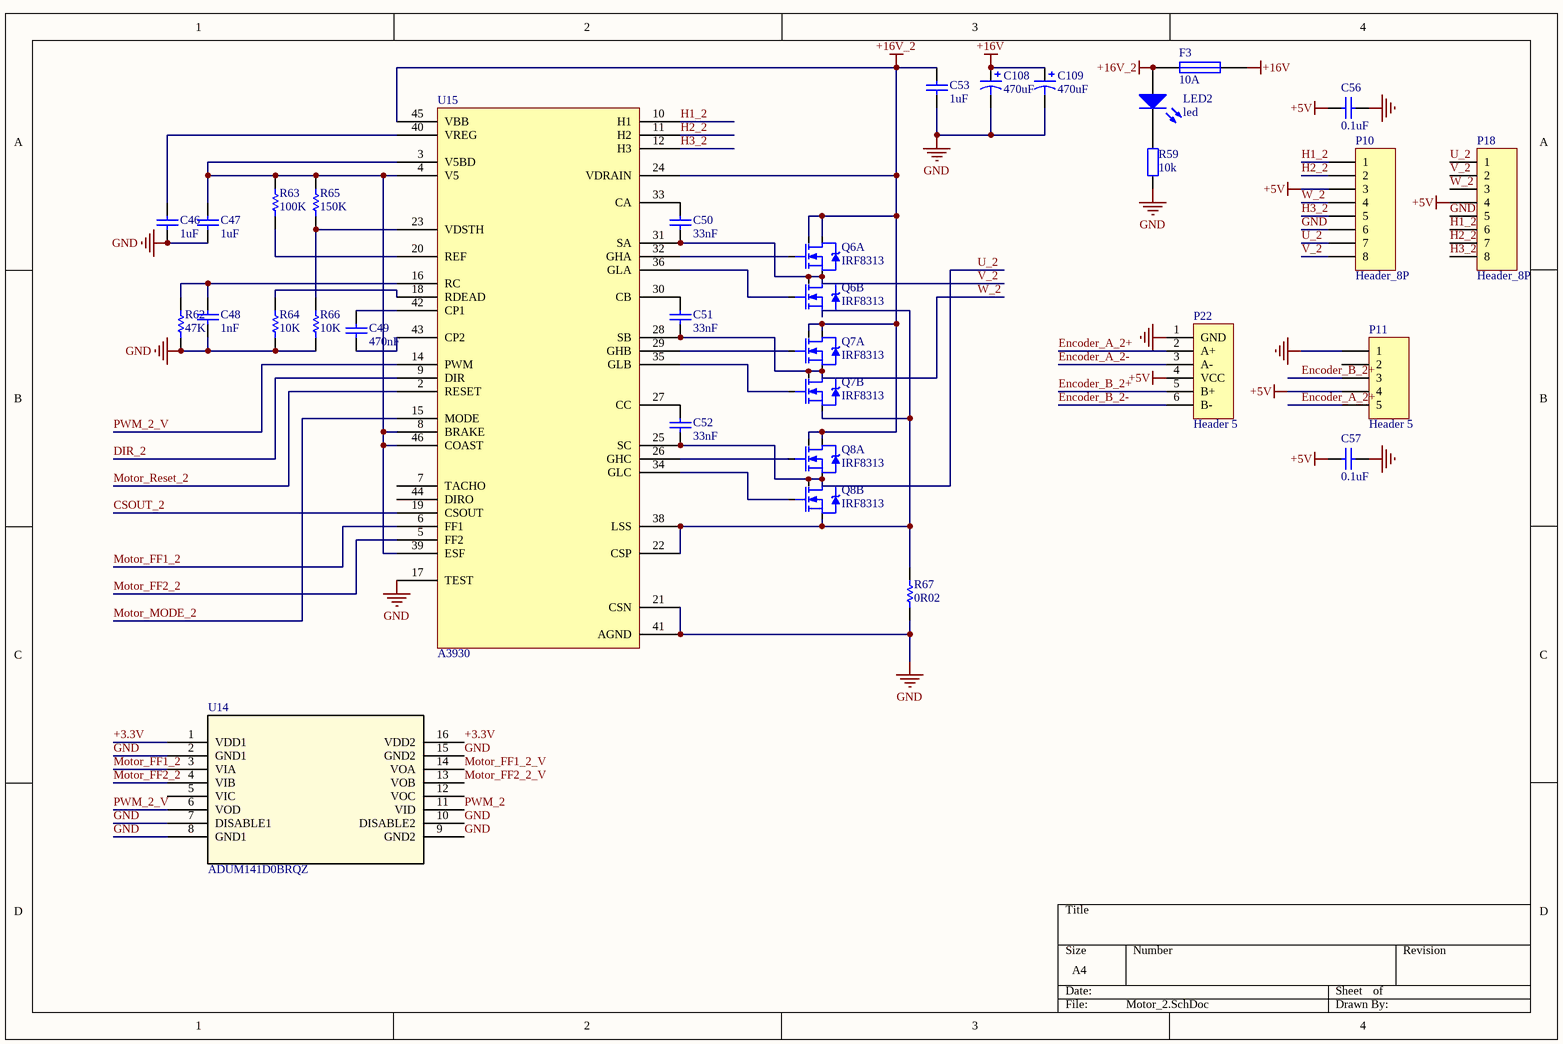
[diagram p3: Motor_2.SchDoc]

### Parts
C46  1uf  [0603C]
C47  1uf  [0603C]
C48  1nf  [0603C]
C49  470nf  [0603C]
C50  33nf  [0603C]
C51  33nf  [0603C]
C52  33nf  [0603C]
C53  1uf  [0603C]
C56  0.1uf  [0603C]
C57  0.1uf  [0603C]
C108  470uF  [470uF]
C109  470uF  [470uF]
F3  10A  [FUSE_HEADER]
LED2  led  [0603_diode]
P10  Header_8P  [8P - WF25122]
P11  Header 5  [SHDR5]
P18  Header_8P  [SHDR8]
P22  Header 5  [SHDR6]
Q6  IRF8313  [so-8 bg]  (parts A,B of 2)
Q7  IRF8313  [so-8 bg]  (parts A,B of 2)
Q8  IRF8313  [so-8 bg]  (parts A,B of 2)
R59  10k  [0603]
R62  47k  [0603R]
R63  100k  [0603R]
R64  10k  [0603R]
R65  value 150K  [0603R]  (hidden comment: 100k)
R66  10k  [0603R]
R67  value 0R02  [1206 10A]  (hidden comment: 0.02)
U14  ADUM141D0BRQZ  [RQ_16]
U15  A3930  [LQFP-48]

### Nets
+3.3V: U14.1(VDD1) U14.16(VDD2)
+5V: C56.2 C57.2 P10.3 P11.4 P18.4 P22.4(VCC)
+16V: C108.1 C109.1 F3.1
+16V_2: C53.2 F3.2 LED2.1(A) Q6.7(D2) Q6.8(D2) Q7.7(D2) Q7.8(D2) Q8.7(D2) Q8.8(D2) U15.24(VDRAIN) U15.45(VBB)
GND: C46.1 C47.1 C48.1 C53.1 C56.1 C57.1 C108.2 C109.2 P10.6 P11.1 P18.5 P22.1(GND) R59.1 R62.1 R64.1 R66.1 R67.1 U14.2(GND1) U14.7(DISABLE1) U14.8(GND1) U14.9(GND2) U14.10(DISABLE2) U14.15(GND2) U15.17(TEST) U15.21(CSN) U15.41(AGND)
CSOUT_2: U15.19(CSOUT)
DIR_2: U15.9(DIR)
Encoder_A_2+: P11.5 P22.2(A+)
Encoder_A_2-: P22.3(A-)
Encoder_B_2+: P11.3 P22.5(B+)
Encoder_B_2-: P22.6(B-)
H1_2: P10.1 P18.6 U15.10(H1)
H2_2: P10.2 P18.7 U15.11(H2)
H3_2: P10.5 P18.8 U15.12(H3)
Motor_FF1_2: U14.3(VIA) U15.6(FF1)
Motor_FF1_2_V: U14.14(VOA)
Motor_FF2_2: U14.4(VIB) U15.5(FF2)
Motor_FF2_2_V: U14.13(VOB)
Motor_MODE_2: U15.15(MODE)
Motor_Reset_2: U15.2(RESET)
PWM_2: U14.11(VID)
PWM_2_V: U14.6(VOD) U15.14(PWM)
U_2: C52.1 P10.7 P18.1 Q8.1(S2) Q8.5(D1) Q8.6(D1) U15.25(SC)
V_2: C50.1 P10.8 P18.2 Q6.1(S2) Q6.5(D1) Q6.6(D1) U15.31(SA)
W_2: C51.1 P10.4 P18.3 Q7.1(S2) Q7.5(D1) Q7.6(D1) U15.28(SB)
NetC46_2: C46.2 U15.40(VREG)
NetC47_2: C47.2 R63.2 R65.2 U15.3(V5BD) U15.4(V5) U15.8(BRAKE) U15.39(ESF) U15.46(COAST)
NetC48_2: C48.2 R62.2 U15.16(RC)
NetC49_1: C49.1 U15.43(CP2)
NetC49_2: C49.2 U15.42(CP1)
NetC50_2: C50.2 U15.33(CA)
NetC51_2: C51.2 U15.30(CB)
NetC52_2: C52.2 U15.27(CC)
NetLED2_2: LED2.2(K) R59.2
NetQ6_2: Q6.2(G2) U15.32(GHA)
NetQ6_3: Q6.3(S1) Q7.3(S1) Q8.3(S1) R67.2 U15.22(CSP) U15.38(LSS)
NetQ6_4: Q6.4(G1) U15.36(GLA)
NetQ7_2: Q7.2(G2) U15.29(GHB)
NetQ7_4: Q7.4(G1) U15.35(GLB)
NetQ8_2: Q8.2(G2) U15.26(GHC)
NetQ8_4: Q8.4(G1) U15.34(GLC)
NetR63_1: R63.1 U15.20(REF)
NetR64_2: R64.2 U15.18(RDEAD)
NetR65_1: R65.1 R66.2 U15.23(VDSTH)

Not connected (* = marked no-connect by the designer): P11 2; U14 5(VIC) 12(VOC); U15 7(TACHO) 44(DIRO)

### Library data of the parts
C46-C53 C56 C57 = Cap: as C14 on sheet Main_Board; Published: 08/06/2000; Publisher: Altium Hobart Technology Centre; SubClass: Capacitor
  C46 C47 C53: Value: 1uF
  C48: Value: 1nF
  C49: Value: 470nF
  C50-C52: Value: 33nF
  C56 C57: Value: 0.1uF
C108 C109 = Cap Pol1: Polarized Capacitor (Radial); Published: 8-Jun-2000; LatestRevisionDate: 17-Jul-2002; LatestRevisionNote: Re-released for DXP Platform.; PackageReference: RB7.6-15; Publisher: Altium Limited; PackageDescription: Polarized Capacitor (Radial); 2 Leads
F3 = FUSE
P10 P18 = Header_8P: Used for Motor connection in ZJUNlict
P11 = Header 5: Header, 5-Pin; LatestRevisionDate: 17-Jul-2002; LatestRevisionNote: Re-released for DXP Platform.; Publisher: Altium Limited
P22 = Header 6: Header, 5-Pin; LatestRevisionDate: 17-Jul-2002; LatestRevisionNote: Re-released for DXP Platform.; Publisher: Altium Limited
Q6-Q8 = SO-8 IRF8313
R59 = res
R62-R67 = Res1: as R1 on sheet Main_Board; Published: 08/06/2000; Publisher: Altium Hobart Technology Centre; SubClass: Resistor
  R62: Value: 47K
  R63: Value: 100K
  R64 R66: Value: 10K
U14 = ADUM141D0BRQZ: Imported; RefDes: RefDes; Type: DEV; Value: Value
U15 = LQFP 48

## Sheet Motor_3.SchDoc
size A4
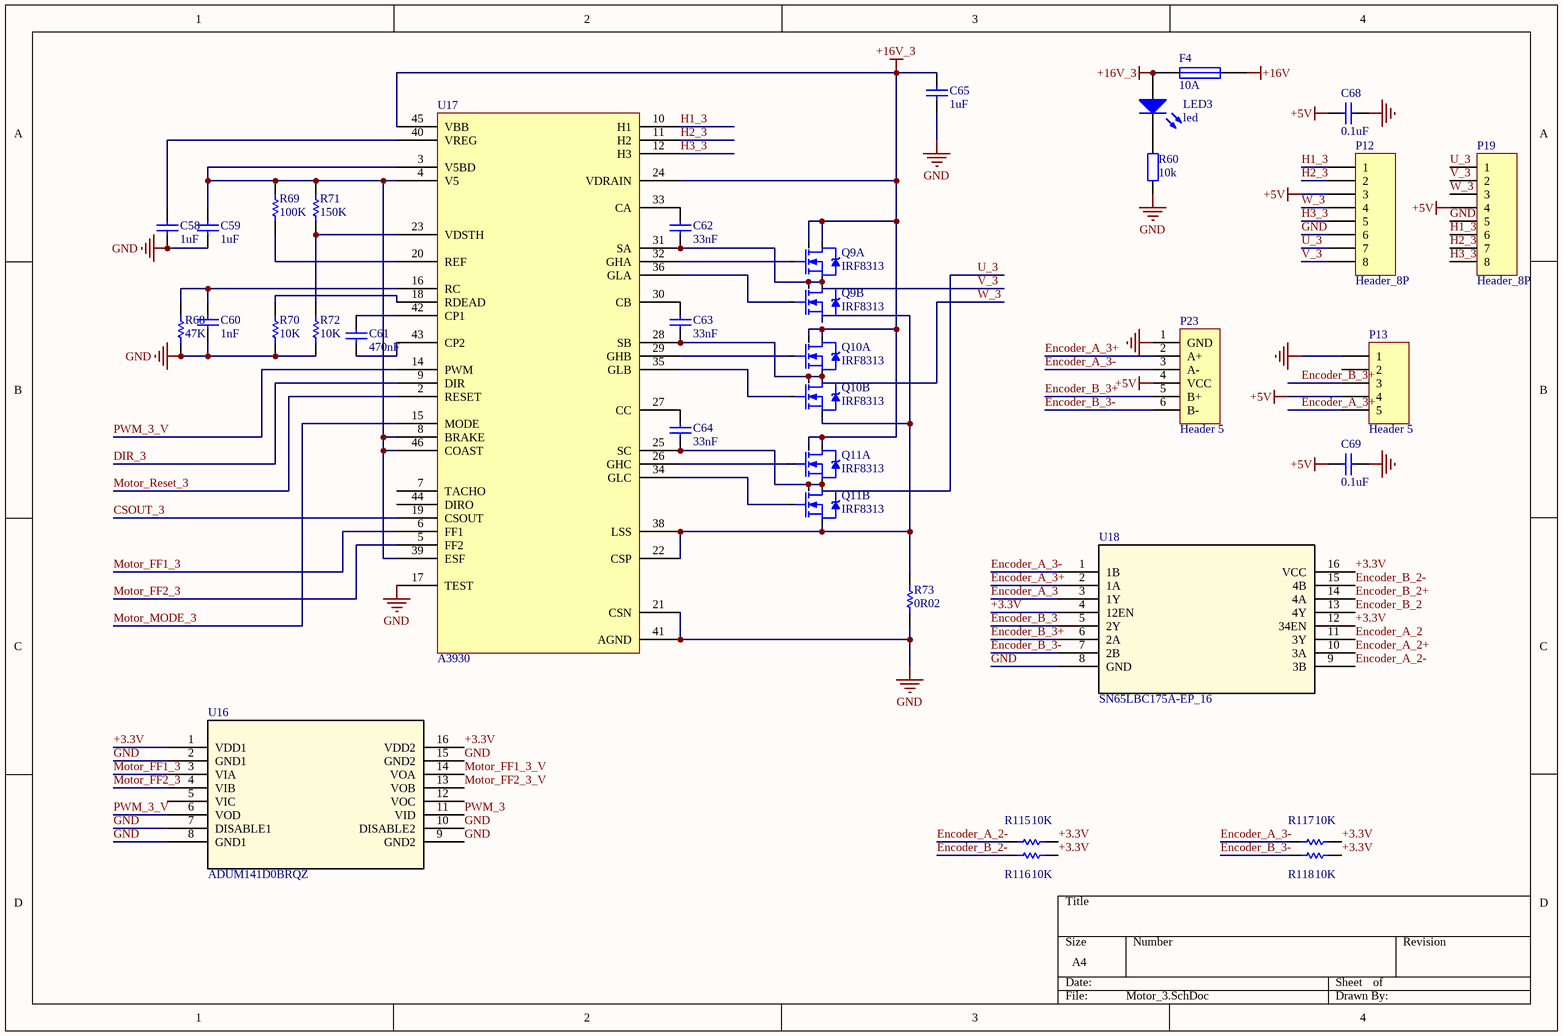
[diagram p4: Motor_3.SchDoc]

### Parts
C58  1uf  [0603C]
C59  1uf  [0603C]
C60  1nf  [0603C]
C61  470nf  [0603C]
C62  33nf  [0603C]
C63  33nf  [0603C]
C64  33nf  [0603C]
C65  1uf  [0603C]
C68  0.1uf  [0603C]
C69  0.1uf  [0603C]
F4  10A  [FUSE_HEADER]
LED3  led  [0603_diode]
P12  Header_8P  [8P - WF25122]
P13  Header 5  [SHDR5]
P19  Header_8P  [SHDR8]
P23  Header 5  [SHDR6]
Q9  IRF8313  [so-8 bg]  (parts A,B of 2)
Q10  IRF8313  [so-8 bg]  (parts A,B of 2)
Q11  IRF8313  [so-8 bg]  (parts A,B of 2)
R60  10k  [0603]
R68  47k  [0603R]
R69  100k  [0603R]
R70  10k  [0603R]
R71  value 150K  [0603R]  (hidden comment: 100k)
R72  10k  [0603R]
R73  value 0R02  [1206 10A]  (hidden comment: 0.02)
R115  10k  [0603R]
R116  10k  [0603R]
R117  10k  [0603R]
R118  10k  [0603R]
U16  ADUM141D0BRQZ  [RQ_16]
U17  A3930  [LQFP-48]
U18  SN65LBC175A-EP_16  [SOP16]

### Nets
+3.3V: R115.1 R116.1 R117.1 R118.1 U16.1(VDD1) U16.16(VDD2) U18.4(12EN) U18.12(34EN) U18.16(VCC)
+5V: C68.2 C69.2 P12.3 P13.4 P19.4 P23.4(VCC)
+16V: F4.1
+16V_3: C65.2 F4.2 LED3.1(A) Q9.7(D2) Q9.8(D2) Q10.7(D2) Q10.8(D2) Q11.7(D2) Q11.8(D2) U17.24(VDRAIN) U17.45(VBB)
GND: C58.1 C59.1 C60.1 C65.1 C68.1 C69.1 P12.6 P13.1 P19.5 P23.1(GND) R60.1 R68.1 R70.1 R72.1 R73.1 U16.2(GND1) U16.7(DISABLE1) U16.8(GND1) U16.9(GND2) U16.10(DISABLE2) U16.15(GND2) U17.17(TEST) U17.21(CSN) U17.41(AGND) U18.8(GND)
CSOUT_3: U17.19(CSOUT)
DIR_3: U17.9(DIR)
Encoder_A_2: U18.11(3Y)
Encoder_A_2+: U18.10(3A)
Encoder_A_2-: R115.2 U18.9(3B)
Encoder_A_3: U18.3(1Y)
Encoder_A_3+: P13.5 P23.2(A+) U18.2(1A)
Encoder_A_3-: P23.3(A-) R117.2 U18.1(1B)
Encoder_B_2: U18.13(4Y)
Encoder_B_2+: U18.14(4A)
Encoder_B_2-: R116.2 U18.15(4B)
Encoder_B_3: U18.5(2Y)
Encoder_B_3+: P13.3 P23.5(B+) U18.6(2A)
Encoder_B_3-: P23.6(B-) R118.2 U18.7(2B)
H1_3: P12.1 P19.6 U17.10(H1)
H2_3: P12.2 P19.7 U17.11(H2)
H3_3: P12.5 P19.8 U17.12(H3)
Motor_FF1_3: U16.3(VIA) U17.6(FF1)
Motor_FF1_3_V: U16.14(VOA)
Motor_FF2_3: U16.4(VIB) U17.5(FF2)
Motor_FF2_3_V: U16.13(VOB)
Motor_MODE_3: U17.15(MODE)
Motor_Reset_3: U17.2(RESET)
PWM_3: U16.11(VID)
PWM_3_V: U16.6(VOD) U17.14(PWM)
U_3: C64.1 P12.7 P19.1 Q11.1(S2) Q11.5(D1) Q11.6(D1) U17.25(SC)
V_3: C62.1 P12.8 P19.2 Q9.1(S2) Q9.5(D1) Q9.6(D1) U17.31(SA)
W_3: C63.1 P12.4 P19.3 Q10.1(S2) Q10.5(D1) Q10.6(D1) U17.28(SB)
NetC58_2: C58.2 U17.40(VREG)
NetC59_2: C59.2 R69.2 R71.2 U17.3(V5BD) U17.4(V5) U17.8(BRAKE) U17.39(ESF) U17.46(COAST)
NetC60_2: C60.2 R68.2 U17.16(RC)
NetC61_1: C61.1 U17.43(CP2)
NetC61_2: C61.2 U17.42(CP1)
NetC62_2: C62.2 U17.33(CA)
NetC63_2: C63.2 U17.30(CB)
NetC64_2: C64.2 U17.27(CC)
NetLED3_2: LED3.2(K) R60.2
NetQ9_2: Q9.2(G2) U17.32(GHA)
NetQ9_3: Q9.3(S1) Q10.3(S1) Q11.3(S1) R73.2 U17.22(CSP) U17.38(LSS)
NetQ9_4: Q9.4(G1) U17.36(GLA)
NetQ10_2: Q10.2(G2) U17.29(GHB)
NetQ10_4: Q10.4(G1) U17.35(GLB)
NetQ11_2: Q11.2(G2) U17.26(GHC)
NetQ11_4: Q11.4(G1) U17.34(GLC)
NetR69_1: R69.1 U17.20(REF)
NetR70_2: R70.2 U17.18(RDEAD)
NetR71_1: R71.1 R72.2 U17.23(VDSTH)

Not connected (* = marked no-connect by the designer): P13 2; U16 5(VIC) 12(VOC); U17 7(TACHO) 44(DIRO)

### Library data of the parts
C58-C65 C68 C69 = Cap: as C14 on sheet Main_Board; Published: 08/06/2000; Publisher: Altium Hobart Technology Centre; SubClass: Capacitor
  C58 C59 C65: Value: 1uF
  C60: Value: 1nF
  C61: Value: 470nF
  C62-C64: Value: 33nF
  C68 C69: Value: 0.1uF
F4 = FUSE
P12 P19 = Header_8P: Used for Motor connection in ZJUNlict
P13 = Header 5: Header, 5-Pin; LatestRevisionDate: 17-Jul-2002; LatestRevisionNote: Re-released for DXP Platform.; Publisher: Altium Limited
P23 = Header 6: Header, 5-Pin; LatestRevisionDate: 17-Jul-2002; LatestRevisionNote: Re-released for DXP Platform.; Publisher: Altium Limited
Q9-Q11 = SO-8 IRF8313
R60 = res
R68-R73 R115-R118 = Res1: as R1 on sheet Main_Board; Published: 08/06/2000; Publisher: Altium Hobart Technology Centre; SubClass: Resistor
  R68: Value: 47K
  R69: Value: 100K
  R70 R72 R115-R118: Value: 10K
U16 = ADUM141D0BRQZ: Imported; RefDes: RefDes; Type: DEV; Value: Value
U17 = LQFP 48
U18 = SN65LBC175A-EP_16: as U13 on sheet Motor_1; Datasheet_URL: http://www.ti.com/lit/gpn/74AC11000; FAMILY_NAME: NAND GATE; RefDes: RefDes; Type: DEV; Value: Value

## Sheet Motor_4.SchDoc
size A4
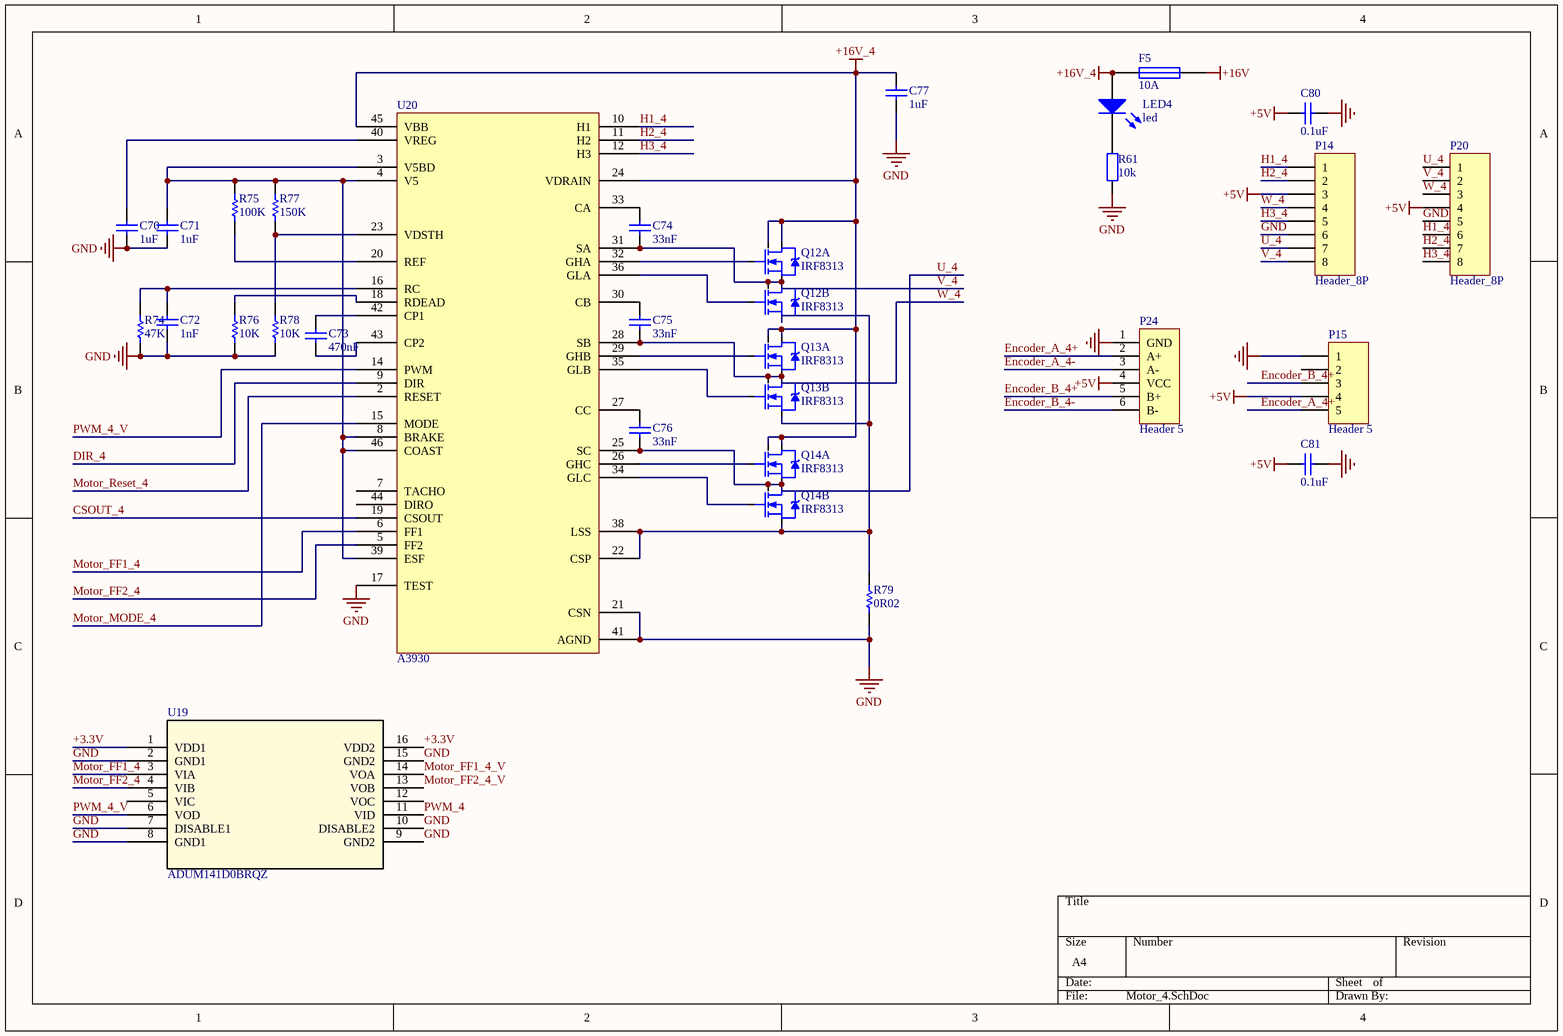
[diagram p5: Motor_4.SchDoc]

### Parts
C70  1uf  [0603C]
C71  1uf  [0603C]
C72  1nf  [0603C]
C73  470nf  [0603C]
C74  33nf  [0603C]
C75  33nf  [0603C]
C76  33nf  [0603C]
C77  1uf  [0603C]
C80  0.1uf  [0603C]
C81  0.1uf  [0603C]
F5  10A  [FUSE_HEADER]
LED4  led  [0603_diode]
P14  Header_8P  [8P - WF25122]
P15  Header 5  [SHDR5]
P20  Header_8P  [SHDR8]
P24  Header 5  [SHDR6]
Q12  IRF8313  [so-8 bg]  (parts A,B of 2)
Q13  IRF8313  [so-8 bg]  (parts A,B of 2)
Q14  IRF8313  [so-8 bg]  (parts A,B of 2)
R61  10k  [0603]
R74  47k  [0603R]
R75  100k  [0603R]
R76  10k  [0603R]
R77  150k  [0603R]
R78  10k  [0603R]
R79  value 0R02  [1206 10A]  (hidden comment: 0.02)
U19  ADUM141D0BRQZ  [RQ_16]
U20  A3930  [LQFP-48]

### Nets
+3.3V: U19.1(VDD1) U19.16(VDD2)
+5V: C80.2 C81.2 P14.3 P15.4 P20.4 P24.4(VCC)
+16V: F5.1
+16V_4: C77.2 F5.2 LED4.1(A) Q12.7(D2) Q12.8(D2) Q13.7(D2) Q13.8(D2) Q14.7(D2) Q14.8(D2) U20.24(VDRAIN) U20.45(VBB)
GND: C70.1 C71.1 C72.1 C77.1 C80.1 C81.1 P14.6 P15.1 P20.5 P24.1(GND) R61.1 R74.1 R76.1 R78.1 R79.1 U19.2(GND1) U19.7(DISABLE1) U19.8(GND1) U19.9(GND2) U19.10(DISABLE2) U19.15(GND2) U20.17(TEST) U20.21(CSN) U20.41(AGND)
CSOUT_4: U20.19(CSOUT)
DIR_4: U20.9(DIR)
Encoder_A_4+: P15.5 P24.2(A+)
Encoder_A_4-: P24.3(A-)
Encoder_B_4+: P15.3 P24.5(B+)
Encoder_B_4-: P24.6(B-)
H1_4: P14.1 P20.6 U20.10(H1)
H2_4: P14.2 P20.7 U20.11(H2)
H3_4: P14.5 P20.8 U20.12(H3)
Motor_FF1_4: U19.3(VIA) U20.6(FF1)
Motor_FF1_4_V: U19.14(VOA)
Motor_FF2_4: U19.4(VIB) U20.5(FF2)
Motor_FF2_4_V: U19.13(VOB)
Motor_MODE_4: U20.15(MODE)
Motor_Reset_4: U20.2(RESET)
PWM_4: U19.11(VID)
PWM_4_V: U19.6(VOD) U20.14(PWM)
U_4: C76.1 P14.7 P20.1 Q14.1(S2) Q14.5(D1) Q14.6(D1) U20.25(SC)
V_4: C74.1 P14.8 P20.2 Q12.1(S2) Q12.5(D1) Q12.6(D1) U20.31(SA)
W_4: C75.1 P14.4 P20.3 Q13.1(S2) Q13.5(D1) Q13.6(D1) U20.28(SB)
NetC70_2: C70.2 U20.40(VREG)
NetC71_2: C71.2 R75.2 R77.2 U20.3(V5BD) U20.4(V5) U20.8(BRAKE) U20.39(ESF) U20.46(COAST)
NetC72_2: C72.2 R74.2 U20.16(RC)
NetC73_1: C73.1 U20.43(CP2)
NetC73_2: C73.2 U20.42(CP1)
NetC74_2: C74.2 U20.33(CA)
NetC75_2: C75.2 U20.30(CB)
NetC76_2: C76.2 U20.27(CC)
NetLED4_2: LED4.2(K) R61.2
NetQ12_2: Q12.2(G2) U20.32(GHA)
NetQ12_3: Q12.3(S1) Q13.3(S1) Q14.3(S1) R79.2 U20.22(CSP) U20.38(LSS)
NetQ12_4: Q12.4(G1) U20.36(GLA)
NetQ13_2: Q13.2(G2) U20.29(GHB)
NetQ13_4: Q13.4(G1) U20.35(GLB)
NetQ14_2: Q14.2(G2) U20.26(GHC)
NetQ14_4: Q14.4(G1) U20.34(GLC)
NetR75_1: R75.1 U20.20(REF)
NetR76_2: R76.2 U20.18(RDEAD)
NetR77_1: R77.1 R78.2 U20.23(VDSTH)

Not connected (* = marked no-connect by the designer): P15 2; U19 5(VIC) 12(VOC); U20 7(TACHO) 44(DIRO)

### Library data of the parts
C70-C77 C80 C81 = Cap: as C14 on sheet Main_Board; Published: 08/06/2000; Publisher: Altium Hobart Technology Centre; SubClass: Capacitor
  C70 C71 C77: Value: 1uF
  C72: Value: 1nF
  C73: Value: 470nF
  C74-C76: Value: 33nF
  C80 C81: Value: 0.1uF
F5 = FUSE
P14 P20 = Header_8P: Used for Motor connection in ZJUNlict
P15 = Header 5: Header, 5-Pin; LatestRevisionDate: 17-Jul-2002; LatestRevisionNote: Re-released for DXP Platform.; Publisher: Altium Limited
P24 = Header 6: Header, 5-Pin; LatestRevisionDate: 17-Jul-2002; LatestRevisionNote: Re-released for DXP Platform.; Publisher: Altium Limited
Q12-Q14 = SO-8 IRF8313
R61 = res
R74-R79 = Res1: as R1 on sheet Main_Board; Published: 08/06/2000; Publisher: Altium Hobart Technology Centre; SubClass: Resistor
  R74: Value: 47K
  R75: Value: 100K
  R76 R78: Value: 10K
  R77: Value: 150K
U19 = ADUM141D0BRQZ: Imported; RefDes: RefDes; Type: DEV; Value: Value
U20 = LQFP 48

## Sheet Motor_d.SchDoc
size A4
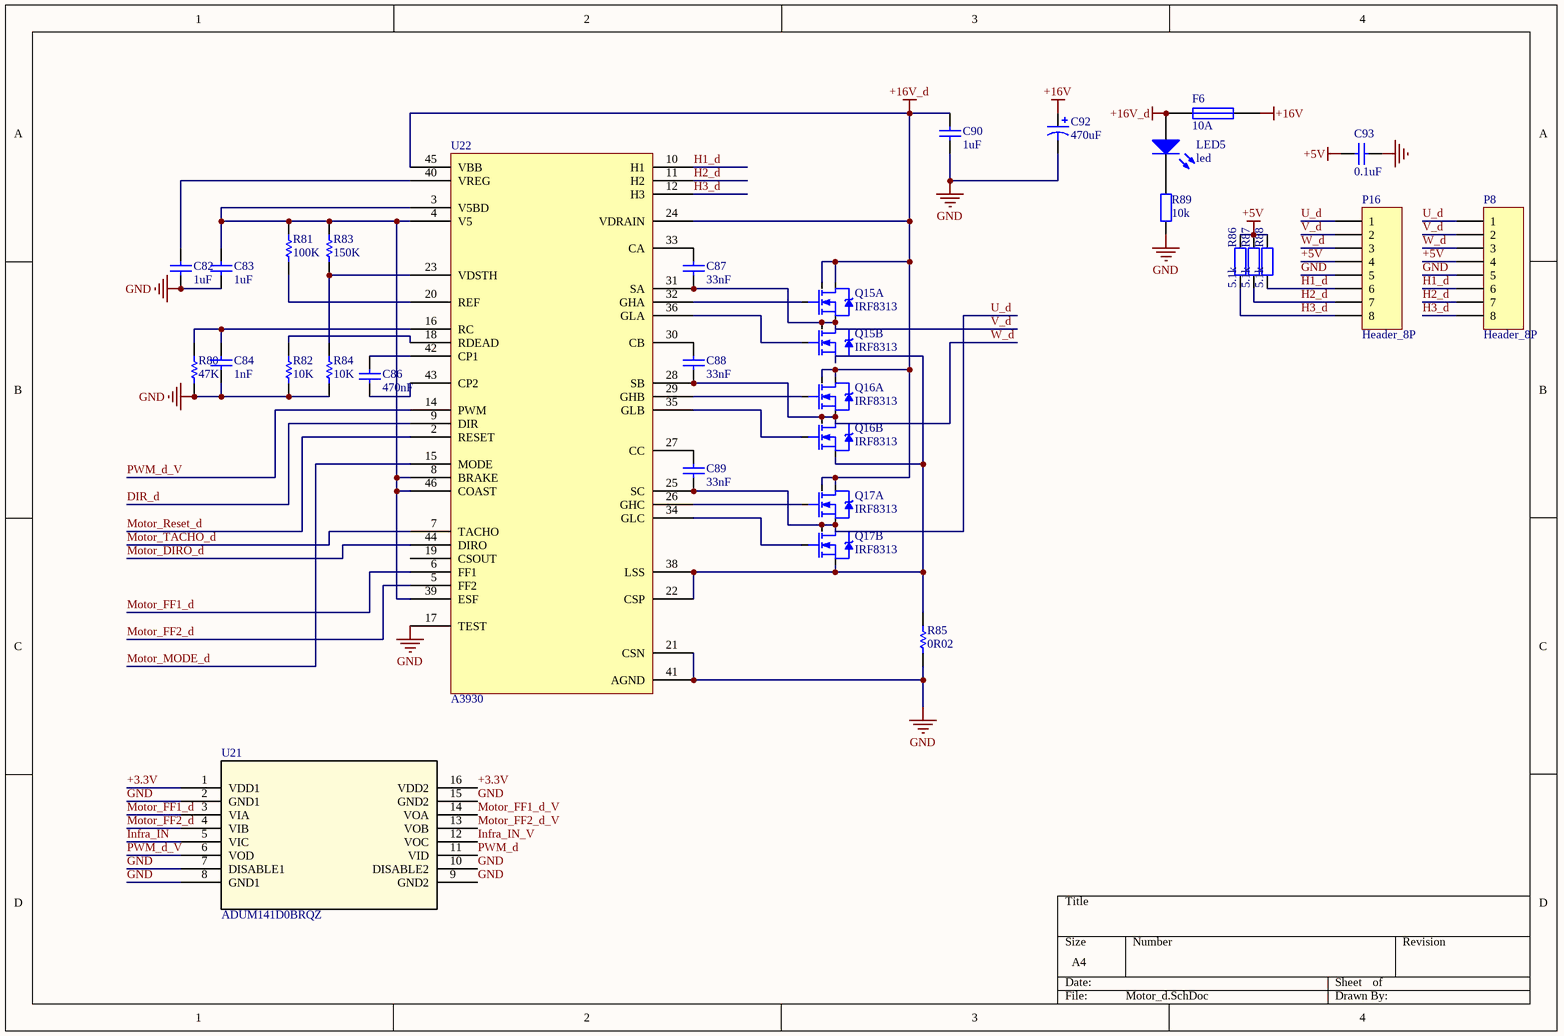
[diagram p6: Motor_d.SchDoc]

### Parts
C82  1uf  [0603C]
C83  1uf  [0603C]
C84  1nf  [0603C]
C86  470nf  [0603C]
C87  33nf  [0603C]
C88  33nf  [0603C]
C89  33nf  [0603C]
C90  1uf  [0603C]
C92  470uF  [470uF]
C93  0.1uf  [0603C]
F6  10A  [FUSE_HEADER]
LED5  led  [0603_diode]
P8  Header_8P  [8P - WF25122]
P16  Header_8P  [SHDR8]
Q15  IRF8313  [so-8 bg]  (parts A,B of 2)
Q16  IRF8313  [so-8 bg]  (parts A,B of 2)
Q17  IRF8313  [so-8 bg]  (parts A,B of 2)
R80  47k  [0603R]
R81  100k  [0603R]
R82  10k  [0603R]
R83  value 150K  [0603R]  (hidden comment: 100k)
R84  10k  [0603R]
R85  value 0R02  [1206 10A]  (hidden comment: 0.02)
R86  5.1k  [0805]
R87  5.1k  [0805]
R88  5.1k  [0805]
R89  10k  [0603]
U21  ADUM141D0BRQZ  [RQ_16]
U22  A3930  [LQFP-48]

### Nets
+3.3V: U21.1(VDD1) U21.16(VDD2)
+5V: C93.2 P8.4 P16.4 R86.1 R87.1 R88.1
+16V: C92.1 F6.1
+16V_d: C90.2 F6.2 LED5.1(A) Q15.7(D2) Q15.8(D2) Q16.7(D2) Q16.8(D2) Q17.7(D2) Q17.8(D2) U22.24(VDRAIN) U22.45(VBB)
GND: C82.1 C83.1 C84.1 C90.1 C92.2 C93.1 P8.5 P16.5 R80.1 R82.1 R84.1 R85.1 R89.1 U21.2(GND1) U21.7(DISABLE1) U21.8(GND1) U21.9(GND2) U21.10(DISABLE2) U21.15(GND2) U22.17(TEST) U22.21(CSN) U22.41(AGND)
DIR_d: U22.9(DIR)
H1_d: P8.6 P16.6 R88.2 U22.10(H1)
H2_d: P8.7 P16.7 R87.2 U22.11(H2)
H3_d: P8.8 P16.8 R86.2 U22.12(H3)
Infra_IN: U21.5(VIC)
Infra_IN_V: U21.12(VOC)
Motor_DIRO_d: U22.44(DIRO)
Motor_FF1_d: U21.3(VIA) U22.6(FF1)
Motor_FF1_d_V: U21.14(VOA)
Motor_FF2_d: U21.4(VIB) U22.5(FF2)
Motor_FF2_d_V: U21.13(VOB)
Motor_MODE_d: U22.15(MODE)
Motor_Reset_d: U22.2(RESET)
Motor_TACHO_d: U22.7(TACHO)
PWM_d: U21.11(VID)
PWM_d_V: U21.6(VOD) U22.14(PWM)
U_d: C89.1 P8.1 P16.1 Q17.1(S2) Q17.5(D1) Q17.6(D1) U22.25(SC)
V_d: C87.1 P8.2 P16.2 Q15.1(S2) Q15.5(D1) Q15.6(D1) U22.31(SA)
W_d: C88.1 P8.3 P16.3 Q16.1(S2) Q16.5(D1) Q16.6(D1) U22.28(SB)
NetC82_2: C82.2 U22.40(VREG)
NetC83_2: C83.2 R81.2 R83.2 U22.3(V5BD) U22.4(V5) U22.8(BRAKE) U22.39(ESF) U22.46(COAST)
NetC84_2: C84.2 R80.2 U22.16(RC)
NetC86_1: C86.1 U22.43(CP2)
NetC86_2: C86.2 U22.42(CP1)
NetC87_2: C87.2 U22.33(CA)
NetC88_2: C88.2 U22.30(CB)
NetC89_2: C89.2 U22.27(CC)
NetLED5_2: LED5.2(K) R89.2
NetQ15_2: Q15.2(G2) U22.32(GHA)
NetQ15_3: Q15.3(S1) Q16.3(S1) Q17.3(S1) R85.2 U22.22(CSP) U22.38(LSS)
NetQ15_4: Q15.4(G1) U22.36(GLA)
NetQ16_2: Q16.2(G2) U22.29(GHB)
NetQ16_4: Q16.4(G1) U22.35(GLB)
NetQ17_2: Q17.2(G2) U22.26(GHC)
NetQ17_4: Q17.4(G1) U22.34(GLC)
NetR81_1: R81.1 U22.20(REF)
NetR82_2: R82.2 U22.18(RDEAD)
NetR83_1: R83.1 R84.2 U22.23(VDSTH)

Not connected (* = marked no-connect by the designer): U22 19(CSOUT)

### Library data of the parts
C82-C84 C86-C90 C93 = Cap: as C14 on sheet Main_Board; Published: 08/06/2000; Publisher: Altium Hobart Technology Centre; SubClass: Capacitor
  C82 C83 C90: Value: 1uF
  C84: Value: 1nF
  C86: Value: 470nF
  C87-C89: Value: 33nF
  C93: Value: 0.1uF
C92 = Cap Pol1: Polarized Capacitor (Radial); Published: 8-Jun-2000; LatestRevisionDate: 17-Jul-2002; LatestRevisionNote: Re-released for DXP Platform.; PackageReference: RB7.6-15; Publisher: Altium Limited; PackageDescription: Polarized Capacitor (Radial); 2 Leads
F6 = FUSE
P8 P16 = Header_8P: Used for Motor connection in ZJUNlict
Q15-Q17 = SO-8 IRF8313
R80-R85 = Res1: as R1 on sheet Main_Board; Published: 08/06/2000; Publisher: Altium Hobart Technology Centre; SubClass: Resistor
  R80: Value: 47K
  R81: Value: 100K
  R82 R84: Value: 10K
R86-R89 = res
U21 = ADUM141D0BRQZ: Imported; RefDes: RefDes; Type: DEV; Value: Value
U22 = LQFP 48

## Nets that join several sheets
+3.3V: Main_Board (84 pins), Motor_1 (9 pins), Motor_2 (U14.1 U14.16), Motor_3 (9 pins), Motor_4 (U19.1 U19.16), Motor_d (U21.1 U21.16)
+5V: Main_Board (17 pins), Motor_1 (6 pins), Motor_2 (6 pins), Motor_3 (6 pins), Motor_4 (6 pins), Motor_d (6 pins)
+16V: Main_Board (JP5.2 JP5.4 JP5.6 R44.2), Motor_1 (C38.1 C107.1 F1_1.1), Motor_2 (C108.1 C109.1 F3.1), Motor_3 (F4.1), Motor_4 (F5.1), Motor_d (C92.1 F6.1)
GND: Main_Board (93 pins), Motor_1 (27 pins), Motor_2 (26 pins), Motor_3 (25 pins), Motor_4 (24 pins), Motor_d (22 pins)
CSOUT_1: Main_Board (U26.7), Motor_1 (U1_1.19)
CSOUT_2: Main_Board (U26.6), Motor_2 (U15.19)
CSOUT_3: Main_Board (U26.11), Motor_3 (U17.19)
CSOUT_4: Main_Board (U26.10), Motor_4 (U20.19)
DIR_1: Main_Board (U1.87), Motor_1 (U1_1.9)
DIR_2: Main_Board (U1.15), Motor_2 (U15.9)
DIR_3: Main_Board (U1.7), Motor_3 (U17.9)
DIR_4: Main_Board (U1.103), Motor_4 (U20.9)
DIR_d: Main_Board (U1.58), Motor_d (U22.9)
Encoder_A_1: Main_Board (U1.60), Motor_1 (U13.3)
Encoder_A_2: Main_Board (U1.34), Motor_3 (U18.11)
Encoder_A_2+: Motor_2 (P11.5 P22.2), Motor_3 (U18.10)
Encoder_A_2-: Motor_2 (P22.3), Motor_3 (R115.2 U18.9)
Encoder_A_3: Main_Board (U1.134), Motor_3 (U18.3)
Encoder_A_4: Main_Board (U1.81), Motor_1 (U13.11)
Encoder_A_4+: Motor_1 (U13.10), Motor_4 (P15.5 P24.2)
Encoder_A_4-: Motor_1 (R111.2 U13.9), Motor_4 (P24.3)
Encoder_B_1: Main_Board (U1.64), Motor_1 (U13.5)
Encoder_B_2: Main_Board (U1.35), Motor_3 (U18.13)
Encoder_B_2+: Motor_2 (P11.3 P22.5), Motor_3 (U18.14)
Encoder_B_2-: Motor_2 (P22.6), Motor_3 (R116.2 U18.15)
Encoder_B_3: Main_Board (U1.135), Motor_3 (U18.5)
Encoder_B_4: Main_Board (U1.82), Motor_1 (U13.13)
Encoder_B_4+: Motor_1 (U13.14), Motor_4 (P15.3 P24.5)
Encoder_B_4-: Motor_1 (R112.2 U13.15), Motor_4 (P24.6)
Infra_IN: Main_Board (JP1.3 R1.2), Motor_d (U21.5)
Infra_IN_V: Main_Board (U1.37), Motor_d (U21.12)
Motor_DIRO_d: Main_Board (U1.42), Motor_d (U22.44)
Motor_FF1_1_V: Main_Board (U1.79), Motor_1 (U11.14)
Motor_FF1_2_V: Main_Board (U1.19), Motor_2 (U14.14)
Motor_FF1_3_V: Main_Board (U1.136), Motor_3 (U16.14)
Motor_FF1_4_V: Main_Board (U1.92), Motor_4 (U19.14)
Motor_FF1_d_V: Main_Board (U1.65), Motor_d (U21.14)
Motor_FF2_1_V: Main_Board (U1.80), Motor_1 (U11.13)
Motor_FF2_2_V: Main_Board (U1.20), Motor_2 (U14.13)
Motor_FF2_3_V: Main_Board (U1.137), Motor_3 (U16.13)
Motor_FF2_4_V: Main_Board (U1.93), Motor_4 (U19.13)
Motor_FF2_d_V: Main_Board (U1.66), Motor_d (U21.13)
Motor_MODE_1: Main_Board (U1.89), Motor_1 (U1_1.15)
Motor_MODE_2: Main_Board (U1.21), Motor_2 (U15.15)
Motor_MODE_3: Main_Board (U1.133), Motor_3 (U17.15)
Motor_MODE_4: Main_Board (U1.90), Motor_4 (U20.15)
Motor_MODE_d: Main_Board (U1.59), Motor_d (U22.15)
Motor_Reset_1: Main_Board (U1.88), Motor_1 (U1_1.2)
Motor_Reset_2: Main_Board (U1.22), Motor_2 (U15.2)
Motor_Reset_3: Main_Board (U1.139), Motor_3 (U17.2)
Motor_Reset_4: Main_Board (U1.91), Motor_4 (U20.2)
Motor_Reset_d: Main_Board (U1.63), Motor_d (U22.2)
Motor_TACHO_d: Main_Board (U1.5), Motor_d (U22.7)
PWM_1: Main_Board (U1.96), Motor_1 (U11.11)
PWM_2: Main_Board (U1.102), Motor_2 (U14.11)
PWM_3: Main_Board (U1.104), Motor_3 (U16.11)
PWM_4: Main_Board (U1.98), Motor_4 (U19.11)
PWM_d: Main_Board (U1.43), Motor_d (U21.11)